# EAGLE board retrostoneH3-18 (EAGLE 7.6.0), part 1 of 4
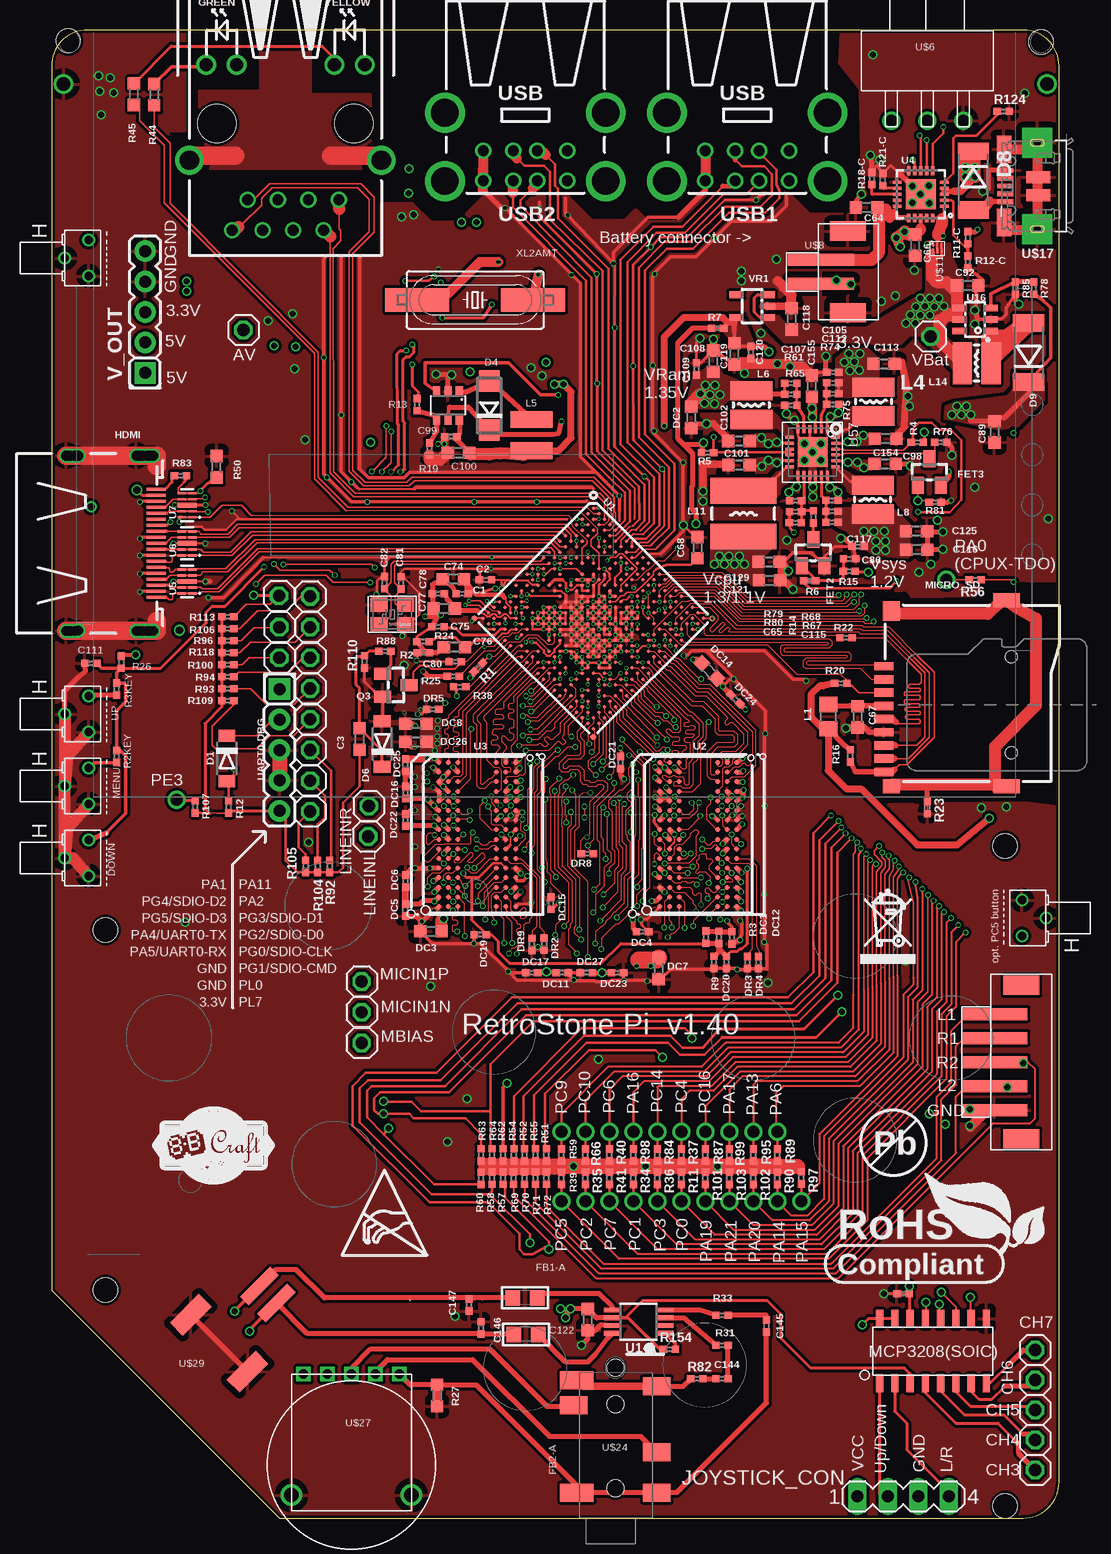
[diagram p6: board, top side]
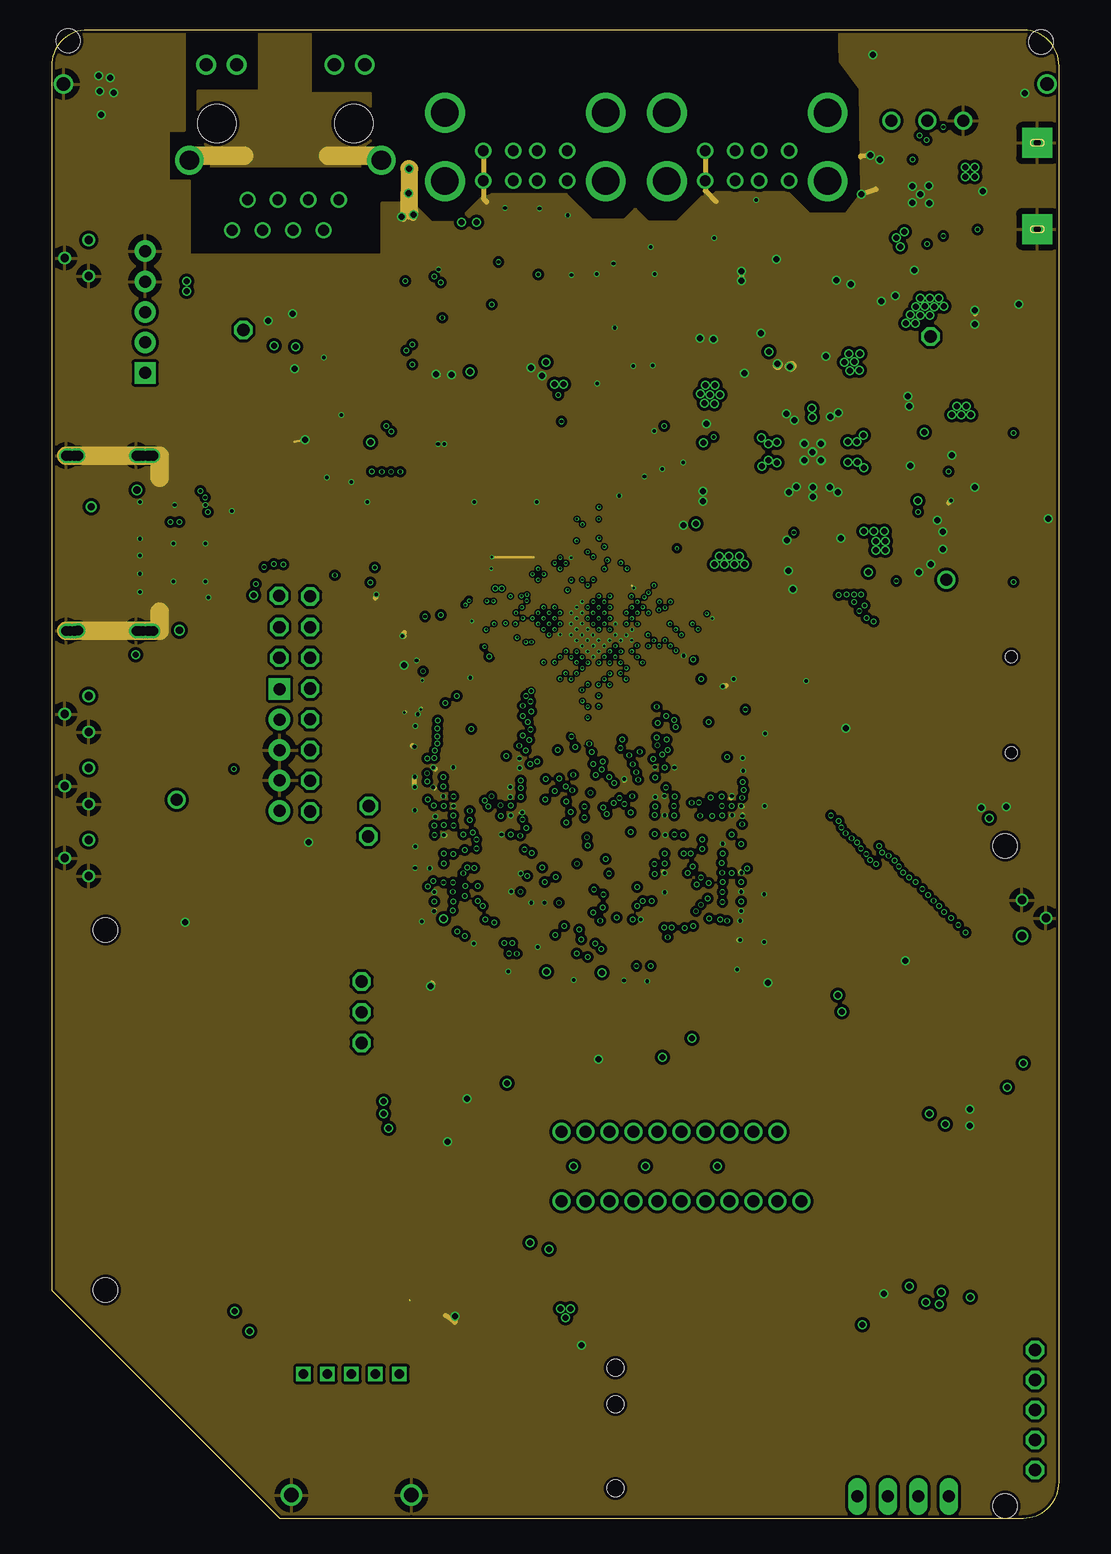
[diagram p7: board, inner layer GND]
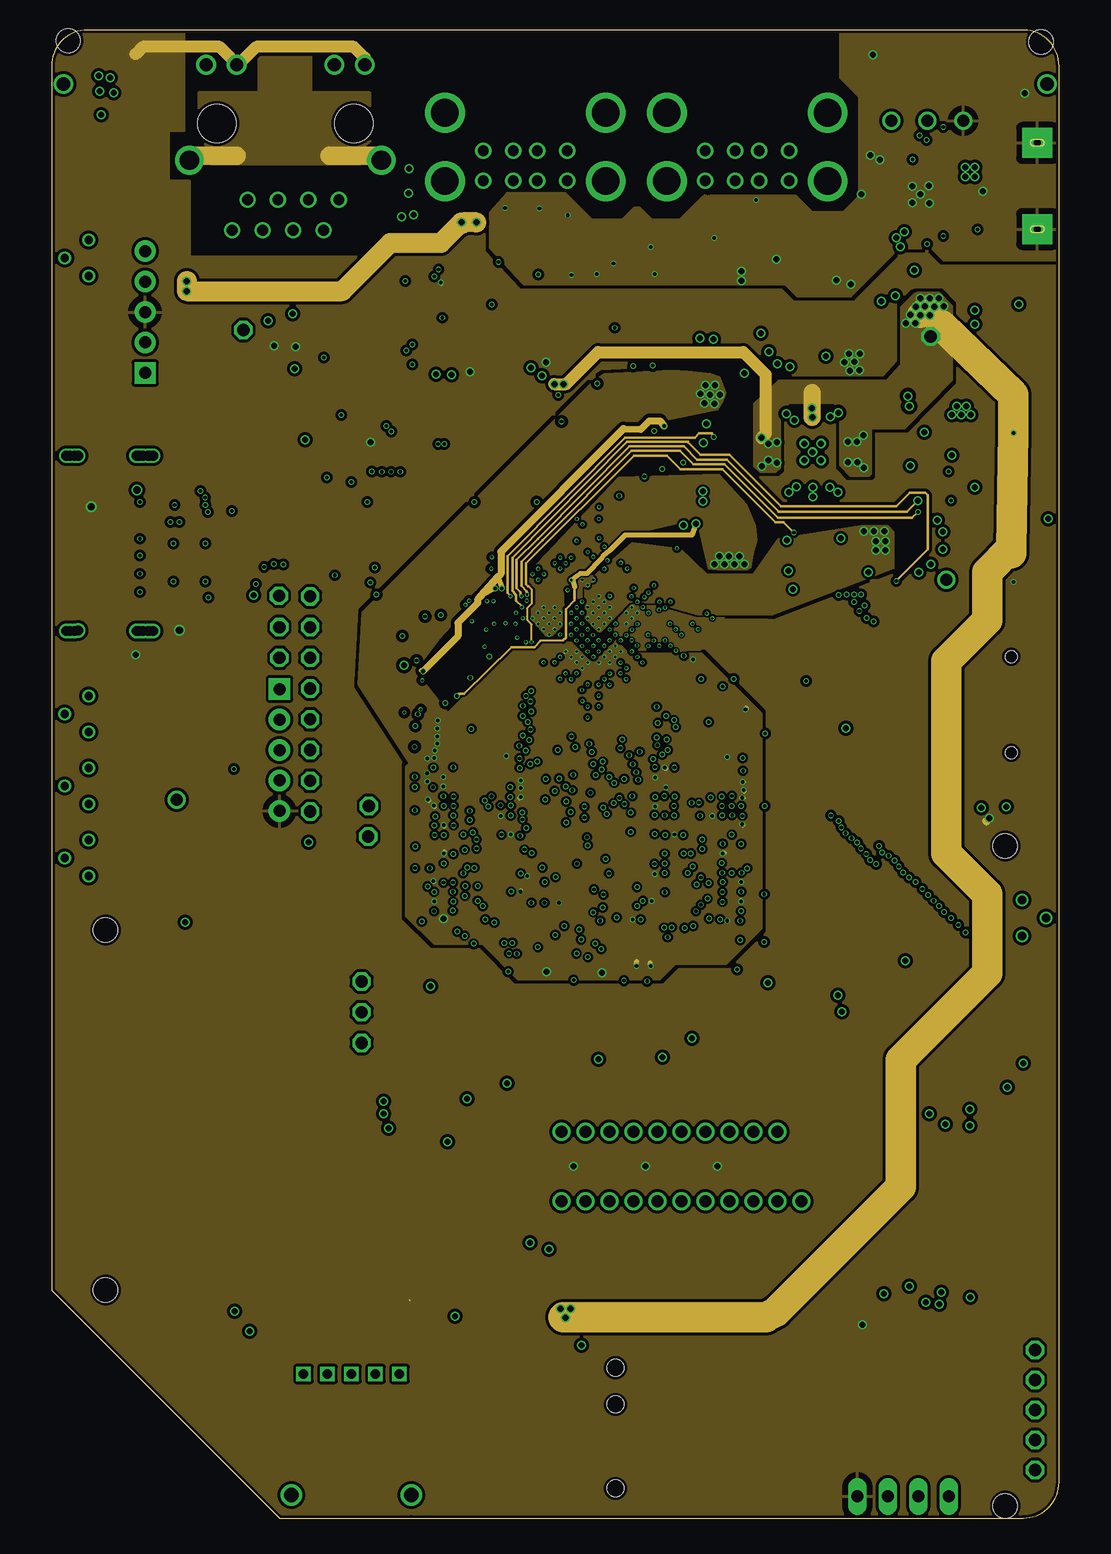
[diagram p8: board, inner layer PWR]
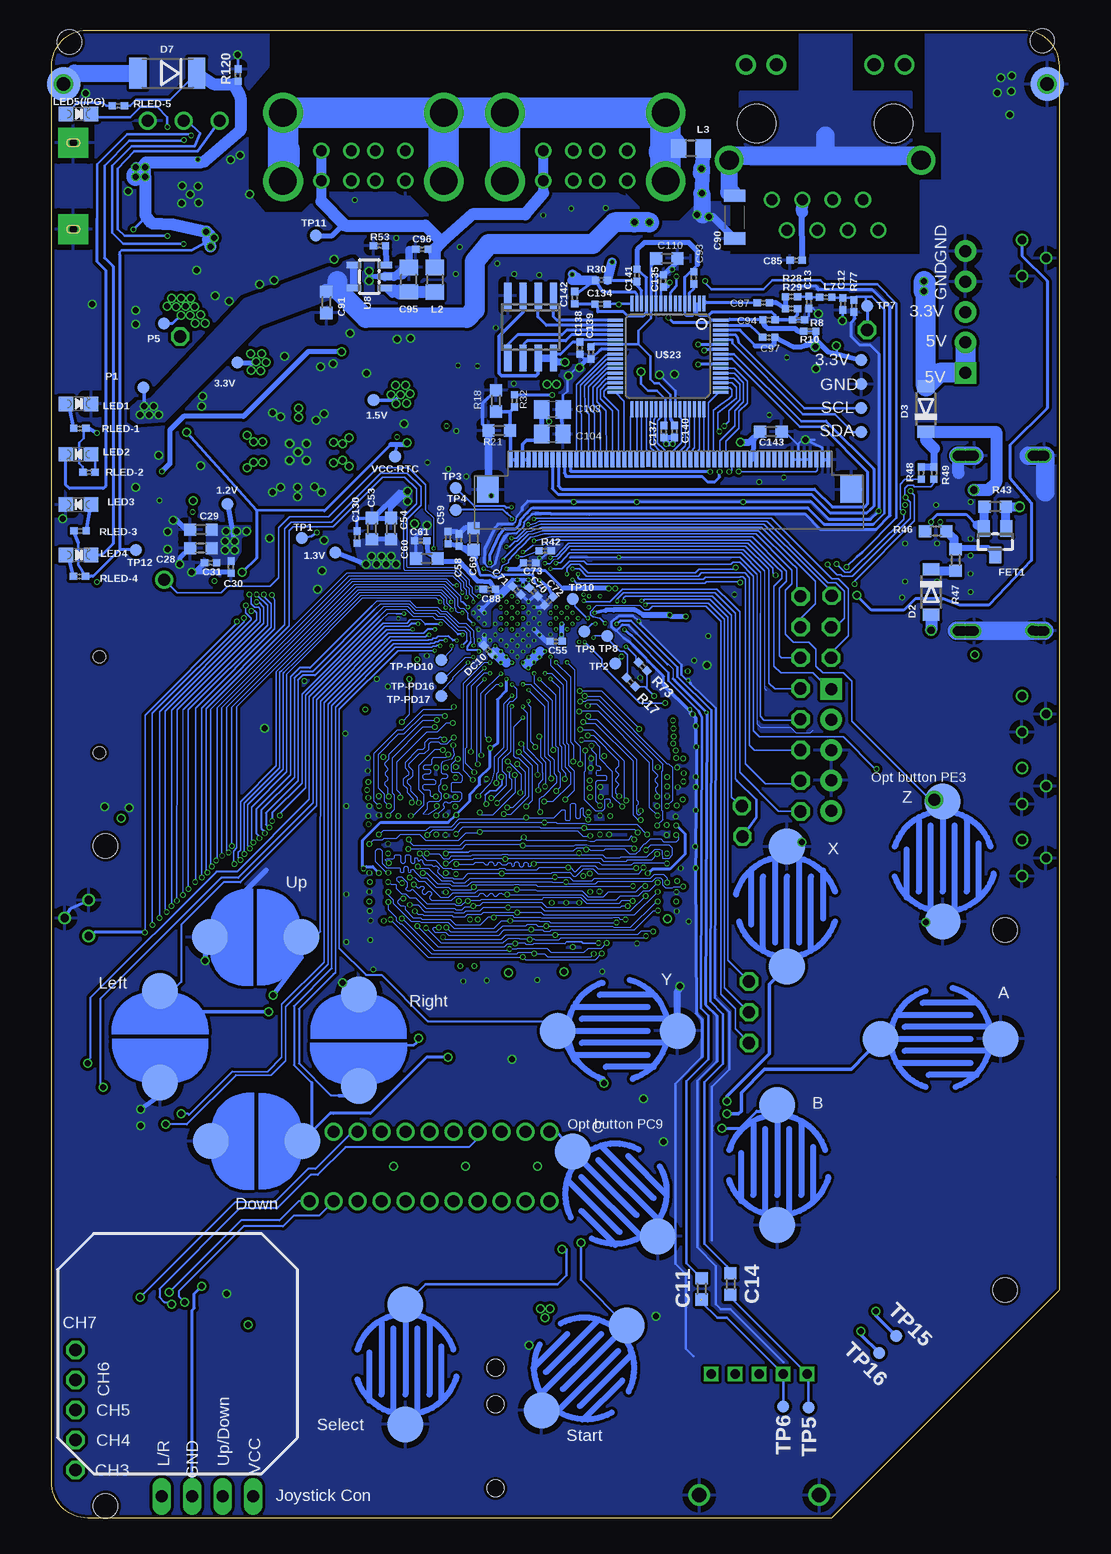
[diagram p9: board, bottom side, seen from below]

Size 84 x 124 mm. Coordinates in mm from the lower left corner, seen from the top.
Outline: 3,124 arc90 0,121 0,28.4 0,19 19,0 30,0 81,0 arc90 84,3 84,121 arc94 80.77,123.99 80.62,123.99 80.37,124 3,124
Copper layers (1*2+15*16): Top 0.035mm / dielectric 5mil / GND 0.035mm / dielectric 0.5mm / PWR 0.035mm / dielectric 5mil / Bottom 0.035mm
Design rules "default *": minimum track width 4mil, minimum drill 0.2mm, track to track 5mil, track to pad 5mil, pad to pad 5mil, via to via 5mil, smd to smd 1mil, copper to edge 10mil, drill to drill 8mil, minimum pad ring 6mil, minimum via ring 2.5mil, stop-mask expansion 4mil, vias tented up to drill 28mil, thermal gap 20mil
Holes 2 mm at 4.5,49 82.5,123 79.5,56 79.5,1 1.4,123.1 4.5,19
Holes 1.4 mm at 47,12.52
tKeepout: area 1,15.5 to 8,22.5; 8 lines
bKeepout: area 2.4,16.9 to 6.6,21.1; 34 lines
tRestrict: area 71,108.8 to 73.9,111.8; 14 lines

## Footprints (pad centres in the part's own frame; a part is rotated, then mirrored left to right if it is on the bottom)
TESTPAD_40-ROUND = smd 1.016 x 1.016: 1 0,0
PADS_DIRECTION = smd 3 x 3: P$1 0,3.81; P$2 0,-3.81
C0402_TI = smd 0.61 x 0.584: 1 -0.508,0; 2 0.508,0
C0603_DWS = smd 1.016 x 1.016: 1 -0.889,0; 2 0.889,0
C1206_5MILS_WS_ISO = smd 1.016 x 1.778: 1 -1.778,0; 2 1.778,0
C0805_5MIL_DWS = smd 1.27 x 1.524: 1 -1.016,0; 2 1.016,0
C0805_5MIL = smd 1.27 x 1.524: 1 -0.889,0; 2 0.889,0
1X01 = drill 1.016 octagon: 1 0,0
RJLBC-060TC1_MILLING = drill 0.9: 1 -4.455,6.35; 2 -3.185,8.89; 3 -1.915,6.35; 4 -0.645,8.89; 5 0.625,6.35; 6 1.895,8.89; 7 3.165,6.35; 8 4.435,8.89 | drill 1.1: AG 4.07,-4.9; AY -6.61,-4.9; KG 6.61,-4.9; KY -4.07,-4.9 | drill 1.6: GND1 -8,3.05; GND2 8,3.05 | hole 3.2: -5.715,0; 5.715,0
SOD-123 = smd 1 x 1.4: A 1.9,0; C -1.9,0
DO214AC = smd 1.8 x 1.7: A 2.05,0; C -2.05,0
MELF-MLL41 = smd 1.45 x 2.6: 1 -2.445,0; 2 2.445,0
R0402_TI = smd 0.61 x 0.584: 1 -0.508,0; 2 0.508,0
CONTACTPIN_ENERGYSQUARE_OD_1MM = drill 1.1: P$1 0,0 | smd 2.8 x 2.8: P$2 0,0
_0805 = smd 1.2 x 1.3: 1 -1.016,0; 2 1.016,0
SOT23 = smd 1.4 x 1: 1 1.1,-0.95; 2 1.1,0.95; 3 -1.1,0
FPC_HAYATO = smd 0.3 x 1.25: 1 1,1.4; 2 1.5,1.4; 3 2,1.4; 4 2.5,1.4; 5 3,1.4; 6 3.5,1.4; 7 4,1.4; 8 4.5,1.4; 9 5,1.4; 10 5.5,1.4; 11 6,1.4; 12 6.5,1.4; 13 7,1.4; 14 7.5,1.4; 15 8,1.4; 16 8.5,1.4; 17 9,1.4; 18 9.5,1.4; 19 10,1.4; 20 10.5,1.4; 21 11,1.4; 22 11.5,1.4; 23 12,1.4; 24 12.5,1.45; 25 13,1.4; 26 13.5,1.4; 27 14,1.4; 28 14.5,1.4; 29 15,1.4; 30 15.5,1.4; 31 16,1.4; 32 16.5,1.4; 33 17,1.4; 34 17.5,1.4; 35 18,1.4; 36 18.5,1.4; 37 19,1.4; 38 19.5,1.4; 39 20,1.4; 40 20.5,1.4; 41 21,1.4; 42 21.5,1.4; 43 22,1.4; 44 22.5,1.4; 45 23,1.4; 46 23.5,1.4; 47 24,1.4; 48 24.5,1.4; 49 25,1.4; 50 25.5,1.4; 51 26,1.4; 52 26.5,1.4; 53 27,1.4; 54 27.5,1.4 | smd 1.8 x 2.2: P$1 -0.9,-1.1; P$56 29.4,-1.1
HDMI-SWM-19 = smd 0.25 x 1.6: 1 -4.5,-5.55; 2 -4,-5.55; 3 -3.5,-5.55; 4 -3,-5.55; 5 -2.5,-5.55; 6 -2,-5.55; 7 -1.5,-5.55; 8 -1,-5.55; 9 -0.5,-5.55; 10 0,-5.55; 11 0.5,-5.55; 12 1,-5.55; 13 1.5,-5.55; 14 2,-5.55; 15 2.5,-5.55; 16 3,-5.55; 17 3.5,-5.55; 18 4,-5.55; 19 4.5,-5.55 | drill 0.8: P$5 -7.3,-4.85; P$7 -7.3,1.25; P$9 7.3,1.25; P$11 7.3,-4.85; P$13 -7.3,-4.45; P$15 -7.3,1.65; P$18 7.3,1.65; P$20 7.3,-4.45; P$21 -7.3,-4.15; P$22 -7.3,-5; P$23 7.3,-5; P$24 7.3,-4.15; P$25 -7.3,-5.3; P$26 7.3,-5.3; P$27 7.3,0.95; P$28 -7.275,0.95; SH1 -7.3,-3.9; SH2 -7.3,1.95; SH3 7.3,1.95; SH4 7.3,-3.9
MA04-1 = drill 1.016 long: 1 -3.81,0; 2 -1.27,0; 3 1.27,0; 4 3.81,0
PAD_BUTTON = smd 3 x 3: P$1 -5,0; P$2 5,0
L0805_5MIL_DWS = smd 1.27 x 1.524: 1 -1.016,0; 2 1.016,0
CD32 = smd 1.6 x 3.5: 1 -1.2,0; 2 1.2,0
CD32_INDUCTOR = smd 3.5 x 1.4: P$1 0,-1.3; P$2 0,1.3
CD52(53) = smd 2.15 x 5.5: 1 -1.9,0; 2 1.9,0
CHIPLED_0805_NOOUTLINE = smd 1.2 x 1.2: A 0,-1.05; C 0,1.05
TFC-WPAPR-08 = smd 1.6 x 0.7: 1 -7.375,2.25; 2 -7.375,1.15; 3 -7.375,0.05; 4 -7.375,-1.05; 5 -7.375,-2.15; 6 -7.375,-3.25; 7 -7.375,-4.35; 8 -7.375,-5.45; 9 -7.375,-6.55 | smd 1.4 x 1.2: 10 -6.75,-7.75 | smd 1.4 x 1.6: 11 -6.75,6.85 | smd 2.2 x 1.2: 12 2.85,-7.75; 13 2.85,7.75 | hole 1: 3.25,-4.95; 3.25,3.05
TSX-3225 = smd 1.4 x 1.15: P$1 -1.1,-0.8; P$2 1.1,-0.8; P$3 1.1,0.8; P$4 -1.1,0.8
R0402_TI_0R = smd 0.61 x 0.584: 1 -0.508,0; 2 0.508,0
R0603_5MIL_DWS = smd 1.016 x 1.016: 1 -0.889,0; 2 0.889,0
0603_0R = smd 1.016 x 1.016: 1 -0.889,0; 2 0.889,0
FBGA-347 = smd 0.3 x 0.3: A1 -6.5,-6.5; A2 -6.5,-5.85; A3 -6.5,-5.2; A4 -6.5,-4.55; A5 -6.5,-3.9; A7 -6.5,-2.6; A8 -6.5,-1.95; A10 -6.5,-0.65; A11 -6.5,0; A13 -6.5,1.3; A14 -6.5,1.95; A16 -6.5,3.25; A17 -6.5,3.9; A19 -6.5,5.2; A20 -6.5,5.85; A21 -6.5,6.5; AA1 6.5,-6.5; AA2 6.5,-5.85; AA3 6.5,-5.2; AA5 6.5,-3.9; AA6 6.5,-3.25; AA8 6.5,-1.95; AA9 6.5,-1.3; AA11 6.5,0; AA12 6.5,0.65; AA14 6.5,1.95; AA15 6.5,2.6; AA17 6.5,3.9; AA18 6.5,4.55; AA19 6.5,5.2; AA20 6.5,5.85; AA21 6.5,6.5; B1 -5.85,-6.5; B2 -5.85,-5.85; B3 -5.85,-5.2; B4 -5.85,-4.55; B5 -5.85,-3.9; B6 -5.85,-3.25; B7 -5.85,-2.6; B8 -5.85,-1.95; B9 -5.85,-1.3; B10 -5.85,-0.65; B11 -5.85,0; B12 -5.85,0.65; B13 -5.85,1.3; B14 -5.85,1.95; B15 -5.85,2.6; B16 -5.85,3.25; B17 -5.85,3.9; B18 -5.85,4.55; B19 -5.85,5.2; B20 -5.85,5.85; B21 -5.85,6.5; C1 -5.2,-6.5; C2 -5.2,-5.85; C3 -5.2,-5.2; C5 -5.2,-3.9; C6 -5.2,-3.25; C7 -5.2,-2.6; C8 -5.2,-1.95; C9 -5.2,-1.3; C10 -5.2,-0.65; C11 -5.2,0; C12 -5.2,0.65; C13 -5.2,1.3; C14 -5.2,1.95; C15 -5.2,2.6; C16 -5.2,3.25; C17 -5.2,3.9; C18 -5.2,4.55; C19 -5.2,5.2; C20 -5.2,5.85; C21 -5.2,6.5; D1 -4.55,-6.5; D2 -4.55,-5.85; D3 -4.55,-5.2; D5 -4.55,-3.9; D6 -4.55,-3.25; D8 -4.55,-1.95; D10 -4.55,-0.65; D11 -4.55,0; D13 -4.55,1.3; D15 -4.55,2.6; D17 -4.55,3.9; D19 -4.55,5.2; D20 -4.55,5.85; E2 -3.9,-5.85; E3 -3.9,-5.2; E8 -3.9,-1.95; E10 -3.9,-0.65; E11 -3.9,0; E13 -3.9,1.3; E14 -3.9,1.95; E15 -3.9,2.6; E16 -3.9,3.25; E18 -3.9,4.55; E19 -3.9,5.2; E20 -3.9,5.85; E21 -3.9,6.5; F1 -3.25,-6.5; F2 -3.25,-5.85; F3 -3.25,-5.2; F5 -3.25,-3.9; F6 -3.25,-3.25; F7 -3.25,-2.6; F8 -3.25,-1.95; F10 -3.25,-0.65; F11 -3.25,0; F13 -3.25,1.3; F14 -3.25,1.95; F16 -3.25,3.25; F17 -3.25,3.9; F18 -3.25,4.55; F19 -3.25,5.2; F20 -3.25,5.85; F21 -3.25,6.5; G1 -2.6,-6.5; G2 -2.6,-5.85; G4 -2.6,-4.55; G5 -2.6,-3.9; G7 -2.6,-2.6; G8 -2.6,-1.95; G9 -2.6,-1.3; G10 -2.6,-0.65; G11 -2.6,0; G12 -2.6,0.65; G13 -2.6,1.3; G14 -2.6,1.95; G15 -2.6,2.6; G18 -2.6,4.55; G20 -2.6,5.85; H2 -1.95,-5.85; H3 -1.95,-5.2; H4 -1.95,-4.55; H6 -1.95,-3.25; H7 -1.95,-2.6; H8 -1.95,-1.95; H10 -1.95,-0.65; H11 -1.95,0; H12 -1.95,0.65; H13 -1.95,1.3; H14 -1.95,1.95; H15 -1.95,2.6; H16 -1.95,3.25; H17 -1.95,3.9; H18 -1.95,4.55; H19 -1.95,5.2; H20 -1.95,5.85; H21 -1.95,6.5; J1 -1.3,-6.5; J2 -1.3,-5.85; J3 -1.3,-5.2; J6 -1.3,-3.25; J7 -1.3,-2.6; J8 -1.3,-1.95; J9 -1.3,-1.3; J10 -1.3,-0.65; J11 -1.3,0; J12 -1.3,0.65; J13 -1.3,1.3; J14 -1.3,1.95; J15 -1.3,2.6; J16 -1.3,3.25; J19 -1.3,5.2; J20 -1.3,5.85; J21 -1.3,6.5; K1 -0.65,-6.5; K2 -0.65,-5.85; K3 -0.65,-5.2; K4 -0.65,-4.55; K6 -0.65,-3.25; K7 -0.65,-2.6; K8 -0.65,-1.95; K9 -0.65,-1.3; K10 -0.65,-0.65; K11 -0.65,0; K12 -0.65,0.65; K13 -0.65,1.3; K14 -0.65,1.95; K15 -0.65,2.6; K16 -0.65,3.25; K17 -0.65,3.9; K18 -0.65,4.55; K20 -0.65,5.85; L2 0,-5.85; L5 0,-3.9; L8 0,-1.95; L9 0,-1.3; L10 0,-0.65; L11 0,0; L12 0,0.65; L13 0,1.3; L14 0,1.95; L15 0,2.6; L16 0,3.25; L17 0,3.9; L18 0,4.55; L19 0,5.2; L20 0,5.85; L21 0,6.5; M1 0.65,-6.5; M2 0.65,-5.85; M3 0.65,-5.2; M4 0.65,-4.55; M5 0.65,-3.9; M6 0.65,-3.25; M7 0.65,-2.6; M8 0.65,-1.95; M9 0.65,-1.3; M10 0.65,-0.65; M11 0.65,0; M12 0.65,0.65; M13 0.65,1.3; M14 0.65,1.95; M15 0.65,2.6; M16 0.65,3.25; M19 0.65,5.2; M20 0.65,5.85; M21 0.65,6.5; N1 1.3,-6.5; N2 1.3,-5.85; N3 1.3,-5.2; N7 1.3,-2.6; N8 1.3,-1.95; N9 1.3,-1.3; N10 1.3,-0.65; N11 1.3,0; N12 1.3,0.65; N13 1.3,1.3; N14 1.3,1.95; N15 1.3,2.6; N16 1.3,3.25; N17 1.3,3.9; N19 1.3,5.2; N20 1.3,5.85; P2 1.95,-5.85; P3 1.95,-5.2; P6 1.95,-3.25; P7 1.95,-2.6; P8 1.95,-1.95; P9 1.95,-1.3; P10 1.95,-0.65; P11 1.95,0; P12 1.95,0.65; P13 1.95,1.3; P14 1.95,1.95; P15 1.95,2.6; P16 1.95,3.25; P17 1.95,3.9; P19 1.95,5.2; P20 1.95,5.85; P21 1.95,6.5; R1 2.6,-6.5; R2 2.6,-5.85; R6 2.6,-3.25; R7 2.6,-2.6; R8 2.6,-1.95; R9 2.6,-1.3; R10 2.6,-0.65; R11 2.6,0; R12 2.6,0.65; R13 2.6,1.3; R14 2.6,1.95; R16 2.6,3.25; R17 2.6,3.9; R18 2.6,4.55; R19 2.6,5.2; R20 2.6,5.85; R21 2.6,6.5; T2 3.25,-5.85; T3 3.25,-5.2; T4 3.25,-4.55; T5 3.25,-3.9; T6 3.25,-3.25; T7 3.25,-2.6; T8 3.25,-1.95; T9 3.25,-1.3; T10 3.25,-0.65; T11 3.25,0; T12 3.25,0.65; T13 3.25,1.3; T14 3.25,1.95; T15 3.25,2.6; T16 3.25,3.25; T17 3.25,3.9; T18 3.25,4.55; T20 3.25,5.85; U2 3.9,-5.85; U3 3.9,-5.2; U4 3.9,-4.55; U6 3.9,-3.25; U9 3.9,-1.3; U11 3.9,0; U15 3.9,2.6; U16 3.9,3.25; U18 3.9,4.55; U19 3.9,5.2; U20 3.9,5.85; U21 3.9,6.5; V1 4.55,-6.5; V2 4.55,-5.85; V3 4.55,-5.2; V4 4.55,-4.55; V5 4.55,-3.9; V6 4.55,-3.25; V10 4.55,-0.65; V11 4.55,0; V12 4.55,0.65; V13 4.55,1.3; V15 4.55,2.6; V17 4.55,3.9; V19 4.55,5.2; V20 4.55,5.85; V21 4.55,6.5; W1 5.2,-6.5; W2 5.2,-5.85; W3 5.2,-5.2; W5 5.2,-3.9; W6 5.2,-3.25; W9 5.2,-1.3; W11 5.2,0; W12 5.2,0.65; W13 5.2,1.3; W15 5.2,2.6; W17 5.2,3.9; W18 5.2,4.55; W20 5.2,5.85; W21 5.2,6.5; Y1 5.85,-6.5; Y2 5.85,-5.85; Y3 5.85,-5.2; Y4 5.85,-4.55; Y7 5.85,-2.6; Y8 5.85,-1.95; Y9 5.85,-1.3; Y10 5.85,-0.65; Y11 5.85,0; Y12 5.85,0.65; Y13 5.85,1.3; Y14 5.85,1.95; Y15 5.85,2.6; Y16 5.85,3.25; Y17 5.85,3.9; Y18 5.85,4.55; Y19 5.85,5.2; Y20 5.85,5.85; Y21 5.85,6.5 | smd 0.5 x 0.5: FID1 -7,7; FID2 7,7; FID3 7,-7
MSOP8_0.65MM = smd 0.4 x 1.4: 1 -0.975,-2.2; 2 -0.325,-2.2; 3 0.325,-2.2; 4 0.975,-2.2; 5 0.975,2.2; 6 0.325,2.2; 7 -0.325,2.2; 8 -0.975,2.2
FBGA96(HYNIX_SAMSUNG_512MX16_DDR3) = smd 0.4 x 0.4: A1 -6,-3.2; A2 -6,-2.4; A3 -6,-1.6; A7 -6,1.6; A8 -6,2.4; A9 -6,3.2; B1 -5.2,-3.2; B2 -5.2,-2.4; B3 -5.2,-1.6; B7 -5.2,1.6; B8 -5.2,2.4; B9 -5.2,3.2; C1 -4.4,-3.2; C2 -4.4,-2.4; C3 -4.4,-1.6; C7 -4.4,1.6; C8 -4.4,2.4; C9 -4.4,3.2; D1 -3.6,-3.2; D2 -3.6,-2.4; D3 -3.6,-1.6; D7 -3.6,1.6; D8 -3.6,2.4; D9 -3.6,3.2; E1 -2.8,-3.2; E2 -2.8,-2.4; E3 -2.8,-1.6; E7 -2.8,1.6; E8 -2.8,2.4; E9 -2.8,3.2; F1 -2,-3.2; F2 -2,-2.4; F3 -2,-1.6; F7 -2,1.6; F8 -2,2.4; F9 -2,3.2; G1 -1.2,-3.2; G2 -1.2,-2.4; G3 -1.2,-1.6; G7 -1.2,1.6; G8 -1.2,2.4; G9 -1.2,3.2; H1 -0.4,-3.2; H2 -0.4,-2.4; H3 -0.4,-1.6; H7 -0.4,1.6; H8 -0.4,2.4; H9 -0.4,3.2; J1 0.4,-3.2; J2 0.4,-2.4; J3 0.4,-1.6; J7 0.4,1.6; J8 0.4,2.4; J9 0.4,3.2; K1 1.2,-3.2; K2 1.2,-2.4; K3 1.2,-1.6; K7 1.2,1.6; K8 1.2,2.4; K9 1.2,3.2; L1 2,-3.2; L2 2,-2.4; L3 2,-1.6; L7 2,1.6; L8 2,2.4; L9 2,3.2; M1 2.8,-3.2; M2 2.8,-2.4; M3 2.8,-1.6; M7 2.8,1.6; M8 2.8,2.4; M9 2.8,3.2; N1 3.6,-3.2; N2 3.6,-2.4; N3 3.6,-1.6; N7 3.6,1.6; N8 3.6,2.4; N9 3.6,3.2; P1 4.4,-3.2; P2 4.4,-2.4; P3 4.4,-1.6; P7 4.4,1.6; P8 4.4,2.4; P9 4.4,3.2; R1 5.2,-3.2; R2 5.2,-2.4; R3 5.2,-1.6; R7 5.2,1.6; R8 5.2,2.4; R9 5.2,3.2; T1 6,-3.2; T2 6,-2.4; T3 6,-1.6; T7 6,1.6; T8 6,2.4; T9 6,3.2
QFN20_4MM = smd 0.73 x 0.28: P$1 -1.965,1; P$2 -1.965,0.5; P$3 -1.965,0; P$4 -1.965,-0.5; P$5 -1.965,-1; P$11 1.965,-1; P$12 1.965,-0.5; P$13 1.965,0; P$14 1.965,0.5; P$15 1.965,1 | smd 0.28 x 0.73: P$6 -1,-1.965; P$7 -0.5,-1.965; P$8 0,-1.965; P$9 0.5,-1.965; P$10 1,-1.965; P$16 1,1.965; P$17 0.5,1.965; P$18 0,1.965; P$19 -0.5,1.965; P$20 -1,1.965 | smd 2.5 x 2.5: P$21 0,0
SLP2510P8 = smd 0.2 x 0.675: 1 -1,-0.438; 2 -0.5,-0.438; 4 0.5,-0.438; 5 1,-0.438; 6 1,0.438; 7 0.5,0.438; 9 -0.5,0.438; 10 -1,0.438 | smd 0.4 x 0.775: 3 0,-0.388; 8 0,0.388
SOT23-5 = smd 1.2 x 0.55: 1 1.3,-0.95; 2 1.3,0; 3 1.3,0.95; 4 -1.3,0.95; 5 -1.3,-0.95
SOT23-6 = smd 1.2 x 0.55: 1 1.3,-0.95; 2 1.3,0; 3 1.3,0.95; 4 -1.3,0.95; 5 -1.3,0; 6 -1.3,-0.95
QFN4X4 = smd 0.7 x 0.25: 1 -1.9,1.225; 2 -1.9,0.725; 3 -1.9,0.225; 4 -1.9,-0.225; 5 -1.9,-0.725; 6 -1.9,-1.225; 13 1.9,-1.225; 14 1.9,-0.725; 15 1.9,-0.225; 16 1.9,0.225; 17 1.9,0.725; 18 1.9,1.225 | smd 0.25 x 0.7: 7 -1.225,-1.9; 8 -0.725,-1.9; 9 -0.225,-1.9; 10 0.225,-1.9; 11 0.725,-1.9; 12 1.225,-1.9; 19 1.225,1.9; 20 0.725,1.9; 21 0.225,1.9; 22 -0.225,1.9; 23 -0.725,1.9; 24 -1.225,1.9 | smd 2.45 x 2.45: 25 0,0 | drill 0.5: P$1 -0.7,0.7; P$2 0.7,0.7; P$3 0.7,-0.7; P$4 -0.7,-0.7; P$5 0,0
JST_PH_VERT_5P = smd 1 x 5.5: 3 -4,-2; 4 -2,-2; 5 0,-2; 6 2,-2; 7 4,-2 | smd 1.6 x 3: GND1 -6.4,0.25; GND2 6.4,0.25
SS-12F21(1P2T) = drill 1: IN 0,0; OUT1 -3,0; OUT2 3,0
JST_PH_VERT_2P = smd 1.6 x 3: GND1 -3.4,0.25; GND2 3.4,0.25 | smd 1 x 5.5: P$1 -1,-2; P$2 1,-2
CSD22205L = smd 0.15 x 0.4: D1 -0.35,-0.225 | smd 0.15 x 0.85: D2 0.35,0; S 0,0 | smd 0.15 x 0.25: G -0.35,0.3
SOT23-6' = smd 0.6 x 0.9: 1 -0.95,-1.15; 2 0,-1.15; 3 0.95,-1.15; 4 0.95,1.15; 5 0,1.15; 6 -0.95,1.15
TACT_SWITCH_HORIZONTAL = drill 0.7: GND 0,1; P$2 1.5,-1; P$3 -1.5,-1
MICROUSB_HAYATO = smd 1 x 2: BASE@1 0.75,2.88; BASE@2 -0.75,2.88 | smd 0.4 x 1.35: D+ 0,0.105; D- 0.65,0.105; GND -1.3,0.105; ID -0.65,0.105; VBUS 1.3,0.105 | smd 2.3 x 1.2: P$1 -3.05,0; P$2 3.05,0 | drill 0.6 pad 2.5 square: SPRT@3 3.6,2.78; SPRT@4 -3.6,2.78
SOIC8 = smd 0.6 x 2.2: 1 -1.905,-2.6; 2 -0.635,-2.6; 3 0.635,-2.6; 4 1.905,-2.6; 5 1.905,2.6; 6 0.635,2.6; 7 -0.635,2.6; 8 -1.905,2.6
LQFP-ST-64-2 = smd 1.3 x 0.25: 1 -4.4,3; 2 -4.4,2.6; 3 -4.4,2.2; 4 -4.4,1.8; 5 -4.4,1.4; 6 -4.4,1; 7 -4.4,0.6; 8 -4.4,0.2; 9 -4.4,-0.2; 10 -4.4,-0.6; 11 -4.4,-1; 12 -4.4,-1.4; 13 -4.4,-1.8; 14 -4.4,-2.2; 15 -4.4,-2.6; 16 -4.4,-3; 33 4.4,-3; 34 4.4,-2.6; 35 4.4,-2.2; 36 4.4,-1.8; 37 4.4,-1.4; 38 4.4,-1; 39 4.4,-0.6; 40 4.4,-0.2; 41 4.4,0.2; 42 4.4,0.6; 43 4.4,1; 44 4.4,1.4; 45 4.4,1.8; 46 4.4,2.2; 47 4.4,2.6; 48 4.4,3 | smd 0.25 x 1.3: 17 -3,-4.4; 18 -2.6,-4.4; 19 -2.2,-4.4; 20 -1.8,-4.4; 21 -1.4,-4.4; 22 -1,-4.4; 23 -0.6,-4.4; 24 -0.2,-4.4; 25 0.2,-4.4; 26 0.6,-4.4; 27 1,-4.4; 28 1.4,-4.4; 29 1.8,-4.4; 30 2.2,-4.4; 31 2.6,-4.4; 32 3,-4.4; 49 3,4.4; 50 2.6,4.4; 51 2.2,4.4; 52 1.8,4.4; 53 1.4,4.4; 54 1,4.4; 55 0.6,4.4; 56 0.2,4.4; 57 -0.2,4.4; 58 -0.6,4.4; 59 -1,4.4; 60 -1.4,4.4; 61 -1.8,4.4; 62 -2.2,4.4; 64 -3,4.4 | smd 0.24 x 1.3: 63 -2.6,4.4
PJ342_6P = smd 1.5 x 2.3: 1 2.15,-3.45; 3 5.5,-3.45; 4 9.45,3.45; 5 11,-3.45 | smd 1.5 x 2.8: 2 2.15,3.2; 6 11.5,3.2 | hole 1.4: 9.5,0; 2.5,0
WHEEL_POT = drill 0.8 square: 2A -2,0; 2B 0,0; 3A 4,0; 3B 2,0; GND -4,0 | drill 1.2: GND1 -5,10.1; GND2 5,10.1
JST2_HAYATO = smd 1 x 3.5: GND 1.6,-4.05; VCC 3.6,-4.05 | smd 1.5 x 3.4: GND2 -0.75,1.7; GND3 5.95,1.7
MCP3208 = smd 0.6 x 1.5: P$1 -4.445,-2.7; P$2 -3.175,-2.7; P$3 -1.905,-2.7; P$4 -0.635,-2.7; P$5 0.635,-2.7; P$6 1.905,-2.7; P$7 3.175,-2.7; P$8 4.445,-2.7; P$9 4.445,2.7; P$10 3.175,2.7; P$11 1.905,2.7; P$12 0.635,2.7; P$13 -0.635,2.7; P$14 -1.905,2.7; P$15 -3.175,2.7; P$16 -4.45,2.7
HN1X5 = drill 1 pad 1.778 square: 1 -5.08,0 | drill 1 pad 1.778: 2 -2.54,0; 3 0,0; 4 2.54,0; 5 5.08,0
USB_TWO_LEVEL_ALINKTEK = drill 0.9: 1.1 -3.5,2.97; 1.2 -1,2.97; 1.3 1,2.97; 1.4 3.5,2.97; 2.1 -3.5,0.47; 2.2 -1,0.47; 2.3 1,0.47; 2.4 3.5,0.47 | drill 2.3: GND1 -6.7,-2.7; GND2 6.7,-2.7; GND3 6.7,3; GND4 -6.7,3
SOT-23-5 = smd 1.2 x 0.55: 1 1.3,-0.95; 2 1.3,0; 3 1.3,0.95; 4 -1.3,0.95; 5 -1.3,-0.95
HC49UP = smd 5.334 x 1.93: 1 -4.826,0; 2 4.826,0

## Placement (x,y rotation side)
1.2V  TESTPADTESTPAD_40-ROUND  [TESTPAD_40-ROUND]  69.32,84.5 0 bottom
1.3V  TESTPADTESTPAD_40-ROUND  [TESTPAD_40-ROUND]  60.33,80.47 270 bottom
1.5V  TESTPADTESTPAD_40-ROUND  [TESTPAD_40-ROUND]  57.15,93.16 180 bottom
3.3V  TESTPADTESTPAD_40-ROUND  [TESTPAD_40-ROUND]  68.5,96.29 90 bottom
AD  PAD_DIRECTION  [PADS_DIRECTION]  66.9,31.4 270 bottom
AL  PAD_DIRECTION  [PADS_DIRECTION]  74.96,40.11 0 bottom
AR  PAD_DIRECTION  [PADS_DIRECTION]  58.4,39.8 180 bottom
AU  PAD_DIRECTION  [PADS_DIRECTION]  67,48.4 270 bottom
C1  100nF/6.3V  [C0402_TI]  34.22,77.02 180 top
C2  100nF/6.3V  [C0402_TI]  36.18,78.17 0 top
C3  10uF/6.3V  [C0603_DWS]  25.68,64.92 90 top
C11  4.7uF/6.3V  [C0603_DWS]  29.8,19.1 90 bottom
C12  150pF  [C0402_TI]  18.02,101.17 90 bottom
C13  150pF  [C0402_TI]  20.87,101.31 90 bottom
C14  4.7uF/6.3V  [C0603_DWS]  27.4,19.5 90 bottom
C28  10uF/6.3V  [C0603_DWS]  71.55,80.82 180 bottom
C29  4.7uF/6.3V  [C0603_DWS]  71.55,82.36 0 bottom
C30  1uF/6.3V  [C0402_TI]  69.04,79.24 90 bottom
C31  100nF/6.3V  [C0402_TI]  70.74,79.6 0 bottom
C53  10uF/6.3V  [C0603_DWS]  57.29,82.44 90 bottom
C54  4.7uF/6.3V  [C0603_DWS]  55.71,82.44 90 bottom
C55  100nF/6.3V  [C0402_TI]  41.94,73.04 0 bottom
C58  1uF/6.3V  [C0402_TI]  50.03,81.5 90 bottom
C59  100nF/6.3V  [C0402_TI]  50.94,81.69 270 bottom
C60  10uF/6.3V  [C0603_DWS]  52.71,79.96 180 bottom
C61  100nF/6.3V  [C0402_TI]  53.23,81.43 0 bottom
C64  10uF/6.3V  [C0603_DWS]  67.95,109.21 0 top
C65  220pF/6.3V  [C0402_TI]  62.01,82.95 0 top
C66  10uF/6.3V  [C0603_DWS]  71.99,106.07 90 top
C67  22uF/6.3V  [C0603_DWS]  67.21,66.76 90 top
C68  10uF/6.3V  [C0603_DWS]  53.86,80.86 90 top
C69  10uF/6.3V  [C0603_DWS]  48.81,81.58 90 bottom
C70  100nF/6.3V  [C0402_TI]  43.82,77.17 135 bottom
C71  100nF/6.3V  [C0402_TI]  45.22,77.3 135 bottom
C72  100nF/6.3V  [C0402_TI]  42.55,76.41 45 bottom
C73  100nF/6.3V  [C0402_TI]  44.14,79.59 180 bottom
C74  10uF/6.3V  [C0603_DWS]  33.51,78.23 0 top
C75  1uF/6.3V  [C0402_TI]  32.21,74.28 0 top
C76  10uF/6.3V  [C0603_DWS]  33.59,72.58 0 top
C77  10uF/6.3V  [C0603_DWS]  32.73,75.79 0 top
C78  100nF/6.3V  [C0402_TI]  32.24,77.02 0 top
C80  100nF/6.3V  [C0402_TI]  33.65,71.36 0 top
C81  18pF  [C0402_TI]  29.14,77.92 270 top
C82  18pF  [C0402_TI]  27.75,77.95 270 top
C85  100nF/6.3V  [C0402_TI]  21.92,104.83 0 bottom
C86  NC  [C0402_TI]  66.53,79.92 0 top
C87  22nF  [C0402_TI]  24.66,101.28 180 bottom
C88  100nF/6.3V  [C0402_TI]  47.49,77.39 0 bottom
C89  22uF/6.3V  [C0603_DWS]  78.61,90.52 270 top
C90  1nF/2kV/X7R/1206  [C1206_5MILS_WS_ISO]  27.04,108.4 90 bottom
C91  22uF/6.3V  [C0603_DWS]  61.09,101.31 270 bottom
C92  22uF/6.3V  [C0603_DWS]  76.38,102.71 180 top
C93  22nF  [C0402_TI]  30.46,103.34 270 bottom
C94  22nF  [C0402_TI]  24.19,99.86 180 bottom
C95  47uF/6.3V  [C0805_5MIL_DWS]  54.21,103.2 90 bottom
C96  100nF/6.3V  [C0402_TI]  53.12,105.73 180 bottom
C97  1uF/6.3V  [C0402_TI]  24.2,98.38 0 bottom
C98  10uF/6.3V  [C0603_DWS]  69.5,87.85 180 top
C99  100nF/6.3V  [C0402_TI]  33.28,90.12 0 top
C100  10uF/6.3V  [C0603_DWS]  33.93,88.77 0 top
C101  10uF/6.3V  [C0603_DWS]  57.32,87.74 0 top
C102  10uF/6.3V  [C0603_DWS]  57.3,89.75 0 top
C103  100nF/25V  [C0805_5MIL]  42.23,92.37 180 bottom
C104  10uF/25V  [C0805_5MIL]  42.24,90.32 180 bottom
C105  100nF/6.3V  [C0402_TI]  65.12,95.49 180 top
C107  22pF  [C0402_TI]  61.64,94.56 0 top
C108  22uF/6.3V  [C0603_DWS]  55.16,96.41 90 top
C109  100nF/6.3V  [C0402_TI]  53.78,95.77 90 top
C110  4.7uF/6.3V  [C0603_DWS]  32.7,104.96 180 bottom
C111  100nF/6.3V  [C0402_TI]  3.27,71.23 0 top
C112  22pF  [C0402_TI]  65.12,94.59 180 top
C113  22uF/6.3V  [C0603_DWS]  69.4,96.18 0 top
C115  33pF  [C0402_TI]  65.07,82.98 180 top
C116  22uF/6.3V  [C0603_DWS]  72.13,80.7 0 top
C117  100nF/6.3V  [C0402_TI]  67.26,80.96 180 top
C118  4.7uF/6.3V  [C0603_DWS]  61.7,99.93 90 top
C119  4.7uF/6.3V  [C0603_DWS]  56.93,97.02 270 top
C120  100nF/6.3V  [C0402_TI]  58.3,97.12 270 top
C121  10uF/6.3V  [C0603_DWS]  59.85,78.14 180 top
C122  10uF/6.3V  [C0603_DWS]  44.69,16.53 90 top
C125  10uF/6.3V  [C0603_DWS]  72.1,82.24 180 top
C129  22uF/6.3V  [C0603_DWS]  59.81,79.69 0 top
C130  100nF/6.3V  [C0402_TI]  58.52,81.73 90 bottom
C134  100nF/6.3V  [C0402_TI]  38.18,101.16 0 bottom
C135  100nF/6.3V  [C0402_TI]  33,103.09 270 bottom
C137  100nF/6.3V  [C0402_TI]  32.96,90.54 90 bottom
C138  100nF/6.3V  [C0402_TI]  39.96,97.48 90 bottom
C139  100nF/6.3V  [C0402_TI]  39.02,97.1 90 bottom
C140  100nF/6.3V  [C0402_TI]  32.06,90.54 90 bottom
C141  20pF  [C0402_TI]  35.18,103.55 270 bottom
C142  20pF  [C0402_TI]  40.38,101.7 90 bottom
C143  4.7uF/6.3V  [C0603_DWS]  24.03,90.53 180 bottom
C144  1uF/6.3V  [C0402_TI]  55.9,11.6 0 top
C145  1uF/6.3V  [C0402_TI]  59.6,16 90 top
C146  220pF/6.3V  [C0402_TI]  35.8,15.85 270 top
C147  220pF/6.3V  [C0402_TI]  34.8,17.75 90 top
C154  10uF/6.3V  [C0603_DWS]  69.53,89.94 180 top
C155  10uF/6.3V  [C0603_DWS]  63.39,94.32 270 top
CH3  [1X01]  82,4 0 top
CH4  [1X01]  82,6.5 0 top
CH5  [1X01]  82,9 0 top
CH6  [1X01]  82,11.5 0 top
CH7  [1X01]  82,14 0 top
CON1  RJLBC-060TC1_GND_MILLING  [RJLBC-060TC1_MILLING]  19.5,116.2 180 top
D1  1N5819(S4SOD-123)  [SOD-123]  14.61,63.29 270 top
D2  1N5819(S4SOD-123)  [SOD-123]  10.67,77.16 270 bottom
D3  1N5819(S4SOD-123)  [SOD-123]  11.11,92.41 90 bottom
D4  SS14  [DO214AC]  36.5,92.71 90 top
D6  1N5819(S4SOD-123)  [SOD-123]  27.56,64.5 90 top
D7  1N5822/SS34/SMA  [MELF-MLL41]  74.35,120.4 180 bottom
D8  1N5822/SS34/SMA  [MELF-MLL41]  76.85,111.45 270 top
D9  1N5822/SS34/SMA  [MELF-MLL41]  81.45,97.13 90 top
DC1  100nF/6.3V  [C0402_TI]  55.63,48.39 270 top
DC2  10uF/6.3V  [C0603_DWS]  53.33,91.7 270 top
DC3  4.7uF/6.3V  [C0603_DWS]  31.63,48.89 180 top
DC4  1uF/6.3V  [C0402_TI]  49.26,48.85 180 top
DC5  1uF/6.3V  [C0402_TI]  29.5,50.67 90 top
DC6  100nF/6.3V  [C0402_TI]  29.51,53.08 270 top
DC7  4.7uF/6.3V  [C0603_DWS]  50.63,45.77 270 top
DC8  10uF/6.3V  [C0603_DWS]  30.39,66.2 180 top
DC10  1uF/6.3V  [C0402_TI]  47.59,72.33 315 bottom
DC11  100nF/6.3V  [C0402_TI]  42.57,45.45 180 top
DC12  1uF/6.3V  [C0402_TI]  56.72,48.35 90 top
DC14  10uF/6.3V  [C0603_DWS]  54.85,70.59 315 top
DC15  1uF/6.3V  [C0402_TI]  41.65,51.23 270 top
DC16  1uF/6.3V  [C0402_TI]  29.5,60.46 270 top
DC17  100nF/6.3V  [C0402_TI]  40.03,45.44 0 top
DC19  100nF/6.3V  [C0402_TI]  35.74,48.62 0 top
DC20  100nF/6.3V  [C0402_TI]  56.26,46.3 90 top
DC21  100nF/6.3V  [C0402_TI]  47.44,62.94 90 top
DC22  100nF/6.3V  [C0402_TI]  29.5,58.16 270 top
DC23  100nF/6.3V  [C0402_TI]  47.19,45.43 180 top
DC24  100nF/6.3V  [C0402_TI]  57.01,68.23 315 top
DC25  1uF/6.3V  [C0402_TI]  29.49,62.74 90 top
DC26  10uF/6.3V  [C0603_DWS]  30.39,64.68 180 top
DC27  1uF/6.3V  [C0402_TI]  44.59,45.45 0 top
DR2  240R/1%  [R0402_TI]  41.07,47.83 90 top
DR3  240R/1%  [R0402_TI]  58.01,46.29 90 top
DR4  240R/1%  [R0402_TI]  58.92,46.29 90 top
DR5  240R/1%  [R0402_TI]  31.78,67.4 0 top
DR8  100R/1%  [R0402_TI]  44.66,55.36 180 top
DR9  240R/1%  [R0402_TI]  40.04,47.8 90 top
ENERGYSQUARE_GND  CONTACTPIN_ENERGYSQUARE1MM  [CONTACTPIN_ENERGYSQUARE_OD_1MM]  1,119.5 0 bottom
ENERGYSQUARE_VBUS  CONTACTPIN_ENERGYSQUARE1MM  [CONTACTPIN_ENERGYSQUARE_OD_1MM]  83,119.5 0 bottom
FB1-A  BLM21PG220SH1D (Ferrite)  [_0805]  39.47,18.35 180 top
FB2-A  BLM21PG220SH1D (Ferrite)  [_0805]  39.55,15.3 180 top
FET1  BSN20(SOT23-3)  [SOT23]  5.33,81.35 90 bottom
FET2  BSN20(SOT23-3)  [SOT23]  63.5,80.45 270 top
FET3  AO3423-PMOS  [SOT23]  73.18,87.17 270 top
FPC54P  FPC_HAYATO  [FPC_HAYATO]  46.74,86.8 0 bottom
HDMI  HDMI-SWM-19  [HDMI-SWM-19]  3.17,81.22 90 top
JOYSTICK_CON  [MA04-1]  71,1.8 0 top
JP1  [1X01]  16,99 0 top
JP2  [1X01]  73.28,98.46 0 top
JP3  [1X01]  26.45,59.33 0 top
JP4  [1X01]  26.4,56.79 0 top
JP5  [1X01]  25.85,39.59 0 top
JP6  [1X01]  25.85,44.71 0 top
JP7  [1X01]  25.85,42.15 0 top
JP8  [1X01]  21.56,66.56 0 top
JP9  [1X01]  21.56,64 0 top
JP10  [1X01]  21.56,69.12 0 top
JP11  [1X01]  21.56,71.68 0 top
JP12  [1X01]  19,74.24 0 top
JP13  [1X01]  19,71.68 0 top
JP14  [1X01]  21.56,61.44 0 top
JP15  [1X01]  21.56,58.88 0 top
JP16  [1X01]  21.56,76.8 0 top
JP17  [1X01]  21.56,74.24 0 top
JP18  [1X01]  18.96,76.85 0 top
K1  PAD_BUTTON  [PAD_BUTTON]  22.69,50.95 90 bottom
K2  PAD_BUTTON  [PAD_BUTTON]  9.88,39.93 0 bottom
K3  PAD_BUTTON  [PAD_BUTTON]  36.8,40.6 0 bottom
K4  PAD_BUTTON  [PAD_BUTTON]  23.5,29.4 270 bottom
L1  FB0805/600R/2A  [L0805_5MIL_DWS]  64.76,66.78 90 top
L2  FB0805/600R/2A  [L0805_5MIL_DWS]  52.04,103.18 270 bottom
L3  FB0805/600R/2A  [L0805_5MIL_DWS]  30.7,114.12 180 bottom
L4  2.2uH/2.0A/DCR<0.1R/CD32  [CD32]  68.52,93.03 90 top
L5  22uH/CD32  [CD32_INDUCTOR]  40.02,90.25 0 top
L6  2.2uH/2.0A/DCR<0.1R/CD32  [CD32]  58.33,92.74 90 top
L7  1.8uH  [C0402_TI]  19.45,101.72 180 bottom
L8  2.2uH/2.0A/DCR<0.1R/CD32  [CD32]  68.46,84.86 270 top
L11  2.2uH/3A/DCR<0.1R/CD54  [CD52(53)]  57.68,83.7 270 top
L14  2.2uH/2.0A/DCR<0.1R/CD32  [CD32]  77.13,96.23 0 top
LED1  BLUE  [CHIPLED_0805_NOOUTLINE]  81.75,92.85 270 bottom
LED2  BLUE  [CHIPLED_0805_NOOUTLINE]  81.75,88.65 90 bottom
LED3  BLUE  [CHIPLED_0805_NOOUTLINE]  81.75,84.45 90 bottom
LED4  BLUE  [CHIPLED_0805_NOOUTLINE]  81.75,80.25 270 bottom
LED5(/PG)  NC(BLUE)  [CHIPLED_0805_NOOUTLINE]  81.75,117 270 bottom
MICRO_SD  TFC-WPAPR-08  [TFC-WPAPR-08]  76.76,68.73 0 top
P1  TESTPADTESTPAD_40-ROUND  [TESTPAD_40-ROUND]  76.33,94.19 0 bottom
P3.3V  TESTPADTESTPAD_40-ROUND  [TESTPAD_40-ROUND]  16.5,96.5 0 bottom
P5  TESTPADTESTPAD_40-ROUND  [TESTPAD_40-ROUND]  74.64,99.53 0 bottom
PGND  TESTPADTESTPAD_40-ROUND  [TESTPAD_40-ROUND]  16.5,94.5 0 bottom
PSCL  TESTPADTESTPAD_40-ROUND  [TESTPAD_40-ROUND]  16.5,92.5 0 bottom
PSDA  TESTPADTESTPAD_40-ROUND  [TESTPAD_40-ROUND]  16.5,90.5 0 bottom
Q1  24MHz 9pF TSX-3225  [TSX-3225]  28.4,75.3 0 top
Q3  BC817-40(SOT23)  [SOT23]  28.7,69.4 180 top
R1  0R(Board_Mounted)  [R0402_TI_0R]  35.59,70.89 225 top
R2  0R(Board_Mounted)  [R0402_TI_0R]  31,72.1 0 top
R2KEY  1k/1%  [R0402_TI]  5.43,63.46 90 top
R3  2k/1%  [R0402_TI]  54.56,48.4 270 top
R3KEY  2.7k/1%  [R0402_TI]  5.43,69.08 90 top
R4  10k/5%  [R0402_TI]  72.17,89.64 180 top
R5  10k/5%  [R0402_TI]  54.69,88.77 0 top
R6  0R(Board_Mounted)  [R0402_TI_0R]  63.2,78.11 180 top
R7  0R(Board_Mounted)  [R0402_TI_0R]  55.52,99.15 0 top
R8  0R(Board_Mounted)  [R0402_TI_0R]  21.72,99.84 180 bottom
R9  2k/1%  [R0402_TI]  55.21,46.31 270 top
R10  0R(Board_Mounted)  [R0402_TI_0R]  20.78,98.91 180 bottom
R11  10k/5%  [R0402_TI]  52.5,28.3 270 top
R11-C  270k/1%  [R0402_TI]  76.39,106.7 270 top
R12  10k/5%  [R0402_TI]  14.77,59.26 270 top
R12-C  100k/1%  [R0402_TI]  76.38,104.67 270 top
R13  1k/1%  [R0402_TI]  30.47,92.78 270 top
R14  30k/1%  [R0402_TI]  63.52,83.43 270 top
R15  10k/5%  [R0402_TI]  66.49,78.9 180 top
R16  10k/5%  [R0402_TI]  66.58,63.51 90 top
R17  10k/5%  [R0402_TI]  35.7,69.65 135 bottom
R18  12R/1%  [R0603_5MIL_DWS]  46.95,93.1 90 bottom
R18-C  1k/1%  [R0402_TI]  68.39,111.62 90 top
R19  10k/5%  [R0402_TI]  31.51,89.07 90 top
R20  10k/5%  [R0402_TI]  65.8,69.56 180 top
R21  12R/1%  [R0603_5MIL_DWS]  46.68,90.62 180 bottom
R21-C  100k/1%  [R0402_TI]  69.29,111.53 90 top
R22  33R/1%  [R0402_TI]  66.24,73.35 180 top
R23  0R(Board_Mounted)  [R0402_TI_0R]  73,59.2 270 top
R24  200k/1%  [R0402_TI]  30.97,73.04 180 top
R25  100k/1%  [R0402_TI]  33.5,70.16 180 top
R26  1k/1%  [R0402_TI]  5.83,71.33 90 top
R27  0R(Board_Mounted)  [0603_0R]  32.14,10.21 90 top
R28  18R/1%  [R0402_TI]  22.32,101.79 180 bottom
R29  56R/1%  [R0402_TI]  22.32,100.79 180 bottom
R30  1M/1%  [R0402_TI]  38.15,103.16 180 bottom
R31  100R/1%  [R0402_TI]  55.9,14.4 180 top
R32  1k/1%  [R0402_TI]  45.41,93.09 90 bottom
R33  100R/1%  [R0402_TI]  55.9,16.9 180 top
R34  10k/5%  [R0402_TI]  48.5,28.3 270 top
R35  10k/5%  [R0402_TI]  44.5,28.3 270 top
R36  NC  [R0402_TI]  50.5,28.3 270 top
R37  NC  [R0402_TI]  52.5,30.25 90 top
R38  10k/5%  [R0402_TI]  34.03,69.26 180 top
R39  10k/5%  [R0402_TI]  42.5,28.3 270 top
R40  NC  [R0402_TI]  46.5,30.25 90 top
R41  NC  [R0402_TI]  46.5,28.3 270 top
R42  6k/1%  [R0402_TI]  42.86,80.6 0 bottom
R43  27k/1%  [R0603_5MIL_DWS]  5.33,84.27 0 bottom
R44  560R/5%  [R0603_5MIL_DWS]  8.56,118.61 270 top
R45  560R/5%  [R0603_5MIL_DWS]  6.87,118.65 270 top
R46  NC(560R)  [R0603_5MIL_DWS]  10.29,82.24 180 bottom
R47  27k/1%  [R0603_5MIL_DWS]  8.64,79.83 90 bottom
R48  2k/1%  [R0402_TI]  11.51,87.07 90 bottom
R49  2k/1%  [R0402_TI]  10.43,87.07 90 bottom
R50  27k/1%  [R0603_5MIL_DWS]  13.76,87.61 90 top
R51  10k/5%  [R0402_TI]  41.25,30.26 90 top
R52  10k/5%  [R0402_TI]  39.44,30.26 90 top
R53  11.8k/1%  [R0402_TI]  56.66,106.02 0 bottom
R54  10k/5%  [R0402_TI]  38.54,30.26 90 top
R55  10k/5%  [R0402_TI]  40.33,30.26 90 top
R56  NC  [R0402_TI]  77,78.2 180 top
R57  10k/5%  [R0402_TI]  37.63,28.32 270 top
R58  10k/5%  [R0402_TI]  36.72,28.32 270 top
R59  10k/5%  [R0402_TI]  42.5,30.25 90 top
R60  10k/5%  [R0402_TI]  35.8,28.3 270 top
R61  150k/1%  [R0402_TI]  61.64,93.64 0 top
R62  10k/5%  [R0402_TI]  37.63,30.26 90 top
R63  10k/5%  [R0402_TI]  35.8,30.27 90 top
R64  10k/5%  [R0402_TI]  36.72,30.27 90 top
R65  100k/1%  [R0402_TI]  61.63,92.74 180 top
R66  10k/5%  [R0402_TI]  44.5,30.25 90 top
R67  10k/1%  [R0402_TI]  65.07,83.9 180 top
R68  10k/1%  [R0402_TI]  65.06,84.8 0 top
R69  10k/5%  [R0402_TI]  38.53,28.32 270 top
R70  10k/5%  [R0402_TI]  39.43,28.32 270 top
R71  10k/5%  [R0402_TI]  40.33,28.32 270 top
R72  10k/5%  [R0402_TI]  41.25,28.32 270 top
R73  10k/5%  [R0402_TI]  34.72,70.95 135 bottom
R74  150k/1%  [R0402_TI]  65.12,93.69 180 top
R75  33k/1%  [R0402_TI]  65.13,92.8 0 top
R76  20k/5%  [R0402_TI]  74.13,89.64 180 top
R77  56R/1%  [R0402_TI]  17.1,101 90 bottom
R78  8.2k/1%  [R0402_TI]  81.88,102.49 270 top
R79  11.8k/1%  [R0402_TI]  62.02,84.76 180 top
R80  10k/1%  [R0402_TI]  62.02,83.87 180 top
R81  100k/1%  [R0402_TI]  73.66,84.65 0 top
R82  30K/1%  [R0402_TI]  53.8,11.6 0 top
R83  20k/5%  [R0402_TI]  10.75,86.87 180 top
R84  10k/5%  [R0402_TI]  50.5,30.25 90 top
R85  1.1k/1%  [R0402_TI]  80.35,102.49 270 top
R87  10k/5%  [R0402_TI]  54.5,30.25 90 top
R88  10k/5%  [R0402_TI]  27.78,72.22 0 top
R89  10k/5%  [R0402_TI]  60.5,30.25 90 top
R90  NC(10k/5%)  [R0402_TI]  60.5,28.3 270 top
R92  NC(10k/5%)  [R0402_TI]  23.2,54.3 90 top
R93  NC(10k/5%)  [R0402_TI]  14.7,69.1 0 top
R94  NC(10k/5%)  [R0402_TI]  14.7,70.1 0 top
R95  NC(10k/5%)  [R0402_TI]  58.5,30.25 90 top
R96  NC(10k/5%)  [R0402_TI]  14.7,73.1 0 top
R97  NC(10k/5%)  [R0402_TI]  62.5,28.35 270 top
R98  NC(10k/5%)  [R0402_TI]  48.5,30.25 90 top
R99  10k/5%  [R0402_TI]  56.5,30.25 90 top
R100  NC(10k/5%)  [R0402_TI]  14.7,71.1 0 top
R101  10k/5%  [R0402_TI]  54.5,28.3 270 top
R102  10k/5%  [R0402_TI]  58.5,28.3 270 top
R103  10k/5%  [R0402_TI]  56.5,28.3 270 top
R104  NC(10k/5%)  [R0402_TI]  22.2,54.3 90 top
R105  NC(10k/5%)  [R0402_TI]  21.2,54.3 90 top
R106  NC(10k/5%)  [R0402_TI]  14.7,74.1 0 top
R107  10k/5%  [R0402_TI]  11.98,59.26 90 top
R108  0R(Board_Mounted)  [R0402_TI_0R]  71,18.7 180 top
R109  NC(10k/5%)  [R0402_TI]  14.7,68.1 0 top
R110  10k/5%  [R0402_TI]  26.1,71.35 90 top
R113  10k/5%  [R0402_TI]  14.7,75.1 0 top
R118  10k/5%  [R0402_TI]  14.7,72.1 0 top
R120  10k/5%  [R0402_TI]  68.46,120.24 90 bottom
R124  10k/5%  [R0402_TI]  79.34,117.21 0 top
R154  10k/5%  [R0402_TI]  51.5,14.05 0 top
RLED-1  10k/5%  [R0402_TI]  81.64,90.8 0 bottom
RLED-2  10k/5%  [R0402_TI]  80.88,87.14 180 bottom
RLED-3  10k/5%  [R0402_TI]  81.62,82.26 180 bottom
RLED-4  10k/5%  [R0402_TI]  81.67,78.46 180 bottom
RLED-5  NC(10k/5%)  [R0402_TI]  78.43,117.69 0 bottom
SELECT  PAD_BUTTON  [PAD_BUTTON]  54.5,12.8 270 bottom
SELECT3  PAD_BUTTON  [PAD_BUTTON]  9.7,54.7 270 bottom
SELECT4  PAD_BUTTON  [PAD_BUTTON]  37,27 315 bottom
START  PAD_BUTTON  [PAD_BUTTON]  39.6,12.5 225 bottom
TP1  TESTPADTESTPAD_40-ROUND  [TESTPAD_40-ROUND]  63.14,81.66 0 bottom
TP2  TESTPADTESTPAD_40-ROUND  [TESTPAD_40-ROUND]  37,71.22 0 bottom
TP3  TESTPADTESTPAD_40-ROUND  [TESTPAD_40-ROUND]  50.3,85.85 0 bottom
TP4  TESTPADTESTPAD_40-ROUND  [TESTPAD_40-ROUND]  50.3,84 0 bottom
TP5  TESTPADTESTPAD_40-ROUND  [TESTPAD_40-ROUND]  20.9,9.2 0 bottom
TP6  TESTPADTESTPAD_40-ROUND  [TESTPAD_40-ROUND]  23,9.3 0 bottom
TP7  TESTPADTESTPAD_40-ROUND  [TESTPAD_40-ROUND]  16,101 0 bottom
TP8  TESTPADTESTPAD_40-ROUND  [TESTPAD_40-ROUND]  37.66,73.51 0 bottom
TP9  TESTPADTESTPAD_40-ROUND  [TESTPAD_40-ROUND]  39.58,73.87 0 bottom
TP10  TESTPADTESTPAD_40-ROUND  [TESTPAD_40-ROUND]  40.55,76.59 0 bottom
TP11  TESTPADTESTPAD_40-ROUND  [TESTPAD_40-ROUND]  61.96,106.87 0 bottom
TP12  TESTPADTESTPAD_40-ROUND  [TESTPAD_40-ROUND]  76.97,80.68 0 bottom
TP15  TESTPADTESTPAD_40-ROUND  [TESTPAD_40-ROUND]  13.59,15.17 315 bottom
TP16  TESTPADTESTPAD_40-ROUND  [TESTPAD_40-ROUND]  15,13.75 315 bottom
TP-PD10  TESTPADTESTPAD_40-ROUND  [TESTPAD_40-ROUND]  51.5,71.5 0 bottom
TP-PD16  TESTPADTESTPAD_40-ROUND  [TESTPAD_40-ROUND]  51.5,70 0 bottom
TP-PD17  TESTPADTESTPAD_40-ROUND  [TESTPAD_40-ROUND]  51.5,68.5 0 bottom
U1  ALLWINNER-H3(FBGA-347)  [FBGA-347]  45.16,74.97 225 top
U1-A  PAM8302AASCR  [MSOP8_0.65MM]  48.95,16.36 90 top
U2  K4B4G1646D-BYK0(FBGA-96_256Mx16_DDR3-1600_11-11-11)  [FBGA96(HYNIX_SAMSUNG_512MX16_DDR3)]  53.92,56.96 270 top
U3  K4B4G1646D-BYK0(FBGA-96_256Mx16_DDR3-1600_11-11-11)  [FBGA96(HYNIX_SAMSUNG_512MX16_DDR3)]  35.49,56.96 270 top
U4  MCP73781T-2CCI/ML  [QFN20_4MM]  72.46,110.31 180 top
U5  RCLAMP0524P  [SLP2510P8]  11.3,78.05 90 top
U6  RCLAMP0524P  [SLP2510P8]  11.3,81.22 90 top
U7  RCLAMP0524P  [SLP2510P8]  11.3,84.4 90 top
U8  SY6280AAC(SOT23-5)  [SOT23-5]  57.51,103.45 0 bottom
U16  SY7152(SOT23-6)  [SOT23-6]  76.99,99.88 0 top
U57  AXP8036  [QFN4X4]  63.45,88.83 270 top
U$4  JST_PH_VERT_5P  [JST_PH_VERT_5P]  80.6,38 270 top
U$6  SS-12F21(1P2T)  [SS-12F21(1P2T)]  73,116.42 0 top
U$8  JST_PH_VERT_2P  [JST_PH_VERT_2P]  66.15,103.85 270 top
U$9  [PB]  70.18,31.27 0 top
U$11  CSD22205L  [CSD22205L]  73.85,105.8 0 top
U$14  KA2707  [SOT23-6']  33.05,92.72 180 top
U$15  TACT_SWITCH_HORIZONTAL  [TACT_SWITCH_HORIZONTAL]  2.1,105 90 top
U$16  [8BCRAFT]  8.3,27.68 0 top
U$17  MICROUSB_HAYATO  [MICROUSB_HAYATO]  79.4,111 270 top
U$18  PM25LV512  [SOIC8]  44.06,99.25 180 bottom
U$23  AMT630A  [LQFP-ST-64-2]  32.6,96.79 270 bottom
U$24  PJ342_5PIN  [PJ342_6P]  47,-0.04 90 top
U$27  WHEEL_POT  [WHEEL_POT]  25,12 180 top
U$29  JST2_HAYATO  [JST2_HAYATO]  17.02,13.93 135 top
U$33  NC/(TACT_SWITCH_HORIZONTAL)  [TACT_SWITCH_HORIZONTAL]  81.9,50 270 top
U$35  MCP3208  [MCP3208]  73.48,13.91 0 top
U$36  TACT_SWITCH_HORIZONTAL  [TACT_SWITCH_HORIZONTAL]  2.1,55 90 top
U$37  TACT_SWITCH_HORIZONTAL  [TACT_SWITCH_HORIZONTAL]  2.1,61 90 top
U$38  TACT_SWITCH_HORIZONTAL  [TACT_SWITCH_HORIZONTAL]  2.1,67 90 top
U$41  [ROHS]  65.51,20.28 0 top
U$42  [RECYCLE_BIN1/8]  67.43,46.2 0 top
U$43  [ESD_SYMBOL]  24.2,21.9 0 top
UART0-DBG  NA(HN1X5)  [HN1X5]  19,64 270 top
USB1  USB_TWO_LEVELALINKTEK  [USB_TWO_LEVEL_ALINKTEK]  58,114.4 180 top
USB2  USB_TWO_LEVELALINKTEK  [USB_TWO_LEVEL_ALINKTEK]  39.5,114.4 180 top
V_OUT  NA(HN1X5)  [HN1X5]  7.8,100.5 90 top
VCC-RTC  TESTPADTESTPAD_40-ROUND  [TESTPAD_40-ROUND]  55.36,88.45 0 bottom
VR1  LC1463CB5ATR33(SOT23-5)  [SOT-23-5]  58.4,100.99 0 top
XL2AMT  27MHz  [HC49UP]  35.31,101.5 180 top

## Tracks (layer width: path | path; a pad name or v marks a point on that pad's centre or on a via)
+3V3_A  (via drill 0.3)
  Top 0.23: v32.57,100.02 36.01,100.02 v36.71,101.12
  Bottom 0.2: U$23.16 36.79,101.19 37.22,101.19 C134.2
  Bottom 0.23: v32.57,100.02 32.17,99.62 29.19,99.62 29,99.81 28.72,99.81 U$23.64 27.56,99.79 27.45,99.9 24.84,99.9 C94.2 | v36.71,101.12 36.7,101.14 36.79,101.19
  Bottom 0.406: 24.73,99.87 C94.2 24.72,99.8 24.47,99.29 24.29,99.11 22,99.11 21.79,98.9 21.5,98.9 R10.2
+5V  (via drill 0.5)
  Top 0.305: R78.2 82.53,101.61 83.3,100.84 83.3,96.68 D9.1
  Top 0.406: v76.62,91.92 76.62,91.41 C89.1 78.89,91.68 79.42,91.68 81.45,93.71 D9.1
  PWR 1.676: v11.27,103.07 v11.27,102.24 v11.28,102.23 24.23,102.23 28.26,106.26 32.47,106.26 v34.17,107.96 | v35.42,107.96 34.33,107.96 34.21,107.84
  Bottom 0.305: P1.1 76.26,94.12 v76.26,92.63
  Bottom 0.4: 60.16,103.09 59.57,102.5 U8.5
  Bottom 0.61: C91.1 61.21,102.5 U8.5 U8.4
  Bottom 1.676: v11.28,102.23 11.28,103 | v34.17,107.96 v35.42,107.96 37.08,107.96 38.89,106.15 47.54,106.16 48.72,104.69 48.72,100.67 49.37,100.02 57.81,100.02 60.16,102.37 60.16,103.09 | V_OUT.2 V_OUT.1 10,95.42 D3.A 11.11,102.91 v11.27,103.07
  other vias: 75.48,92.63 75.85,91.93 75.07,91.94
  pour Top (isolate 0.3, no thermals): 80.23,95.49 80.23,94.16 79.62,93.52 75.37,92.97 74.46,92.63 74.37,91.6 78.97,90.67 80.33,90.87 80.77,91.05 80.77,91.13 82.81,93.17 82.81,94.29 82.18,94.92
  pour Bottom (isolate 0.3, no thermals): 76.3,93.11 76.83,93.11 77.43,92.53 77.43,91.6 76.8,91.18 74.59,91.35 66.64,99.36 58.87,102.27 58.41,102.73 58.41,104.46 58.92,104.97 67.96,101.61 75.75,93.35
+5V_USB
  Bottom 0.406: TP11.1 60.6,106.87 59.64,107.83
  Bottom 0.61: 52.12,105.53 52.12,105.71 C96.1
  Bottom 0.813: 61.5,109.69 USB1.1.1 USB1.2.1 | 43,110.42 USB2.1.1 USB2.2.1
  Bottom 1.016: L2.1 52.03,105.43 52.12,105.53 | 43,110.42 44.51,108.64 48.92,108.64 51.48,106.34 | 51.48,106.34 52.12,105.71 | 61.5,109.69 59.64,107.83 59.5,107.69 52.83,107.69 51.48,106.34
+7V  (via drill 0.2, 0.3, 0.5)
  Top 0.229: v43.33,78.16 43.31,78.13 43.3,77.79 43.3,77.71 U1.K6
  Top 0.25: 54.33,88.76 R5.1 | v72.75,90.46 72.75,89.7 R4.1 | v68.1,78.8 67.09,78.8 R15.1
  Top 0.254: v33.77,68.52 33.77,69 R38.2
  Top 0.406: R5.1 54.34,89.51 v54.34,89.62 54.31,89.5 52.7,89.5 | R7.1 53.45,99.15 52.2,97.9 52.2,90 52.7,89.5 | 52.7,89.5 53.45,88.75 53.45,86.05 53.35,85.95 53.35,84.15 53.72,83.78 v53.72,82.87
  PWR 0.2: 43.6,77.6 43.6,76.47 42.88,75.75 42.88,73.37 42.64,73.13 40.75,73.12 40.25,72.57 38.35,72.57 34.38,68.7 33.95,68.7 v33.77,68.52
  PWR 0.406: v53.72,82.87 53.4,81.9 47.81,81.9 46.5,80.59 46,80.19 45.85,80 44.6,78.7 44.08,78.7 43.74,78.46 v43.33,78.16 43.43,78.22 43.6,77.6
  Bottom 0.127: R73.1 34.36,69.11 v33.77,68.52 34.54,69.29 R17.1
  Bottom 0.25: 54.28,89.57 v54.34,89.62 | 55.7,89.46 61.24,83.92 66.91,83.97 | 66.91,83.97 v72.75,90.46 | 66.91,83.97 66.91,80 v68.1,78.8
  Bottom 0.254: 33.83,68.58 v33.77,68.52 | 54.28,89.57 55.28,89.33 VCC-RTC.1
  Bottom 0.305: C72.2 42.63,77.61 v43.33,78.16
  Bottom 0.406: 55.7,89.46 54.39,89.46 v54.34,89.62
AGND
  Bottom 0.2: 29.25,100.2 29.95,100.2 30.21,100.31 30.21,101.05 U$23.2 | U$23.3 30.4,100.35 30.55,100.2 31.05,100.2 31.19,100.29 31.19,101.13 U$23.5
  Bottom 0.23: 29.25,100.2 29.15,100.3 | C93.1 30.6,103.99 30.6,104
  Bottom 0.25: U$23.3 U$23.2 | C141.1 34.4,103.37 U$23.13 34.4,100.43 34.67,100.16 35.94,100.16 36.3,100.52 38.45,100.52 38.45,100.84 C134.1 | U$23.5 31.2,103.4 30.6,104 30.15,104.45 | C94.1 23.68,100.23 23.95,100.5 28.95,100.5 29.15,100.3
  Bottom 0.254: C134.1 40.34,101.15 C142.1
  Bottom 0.3: R8.2 23.66,99.84 C94.1
  Bottom 0.305: R8.2 21.81,100.26 R29.1
  Bottom 0.406: 30.15,104.45 30.15,105.58 30.86,106.29 34.57,106.29 35.19,105.67 C141.1
AGNDA
  Top 0.406: U$27.GND 29.9,11.1 R27.2 35.4,11.1 40.9,5.6 41.1,5.4 43.8,2.7 U$24.2 U$24.1 52.11,2.11 59.6,9.6 C145.1
AGNDJ  (via drill 0.5)
  Top 0.25: U$35.P$14 71.51,16.68 R108.1 v71.5,19.3
  Bottom 0.25: JOYSTICK_CON.3 72.27,17.33 72.1,17.5 72.1,18.7 v71.5,19.3
AIN+
  Top 0.406: U$24.6 43.8,11.5 44.3,11.5 44.3,10.96 | 49.9,10.96 U$24.5 52.65,10.96 R82.1
  Top 0.61: 44.3,10.96 49.9,10.96
AP-NMI#
  Top 0.102: R38.1 34.53,69.2 34.84,69.24 U1.AA6
AP-RESET#  (via drill 0.2)
  Top 0.102: U1.V6 39.19,74.05 38.85,73.72 38.37,73.72 38.11,73.46 37.69,73.46 36.84,72.61 v36.11,72.61 35.85,72.61 34.61,71.36 C80.2
  Top 0.15: 34.16,71.28 34.14,71.28 33.6,70.74 31.66,70.74 31.38,71.02 30.7,71.02 30.14,70.46 30.14,69.74 Q3.3
  Top 0.2: C80.2 34.16,71.28
  Bottom 0.127: v36.11,72.61 36.09,72.61 35.28,71.8 35.28,71.51 R73.2
AUDIOL  (1 unrouted)
  Bottom 0.2: TP6.1 U$27.3B 27.7,16.7 28.5,16.7 29.8,18 C11.1 | 29.9,18.11 29.89,18.1
AUDIOR
  Bottom 0.2: TP5.1 20.9,11.9 U$27.3A 27.4,18.4 C14.1
B0
  Bottom 0.127: U$23.24 37.03,96.96 37.75,96.96 40.24,94.45 FPC54P.12
B1
  Bottom 0.127: U$23.25 37.02,96.58 37.72,96.58 39.89,94.41 39.89,92.08 39.83,92.01 39.83,88.29 FPC54P.13
B2
  Bottom 0.127: FPC54P.14 39.24,88.71 39.21,91.98 39.54,92.35 39.55,94.36 37.71,96.2 U$23.26
B3
  Bottom 0.127: FPC54P.15 38.73,92.07 39.22,92.61 39.22,94.29 37.7,95.81 37.02,95.81 U$23.27
B4
  Bottom 0.127: FPC54P.16 38.22,92.15 38.88,92.83 38.88,94.24 37.68,95.43 37.04,95.43 U$23.28
B5
  Bottom 0.127: FPC54P.17 37.79,92.26 38.55,93.03 38.55,94.15 37.77,94.93 37.07,94.93 U$23.29
B6
  Bottom 0.127: FPC54P.18 37.24,92.27 38.24,93.26 38.24,94.02 37.73,94.55 37.05,94.55 U$23.30
B7
  Bottom 0.127: FPC54P.19 36.74,92.28 37.94,93.5 37.94,93.9 37.71,94.15 37.03,94.16 U$23.31
B/L_EN  (via drill 0.3)
  Top 0.2: 30.61,93.81 R13.1
  Top 0.23: 30.61,93.81 30.09,94.33 v30.09,96.14
  Bottom 0.23: v30.09,96.14 30.03,96.19 U$23.55
CH3
  Top 0.254: U$35.P$4 72.84,10.46 75.4,7.9 78.9,7.9 80.3,6.5
  Top 0.406: 80.3,6.5 80.6,6.2 80.6,5.4 CH3.1
CPUX-VSET  (via drill 0.2, 0.3)
  Top 0.2: U1.T4 v39.21,75.89 v39.2,75.89 | v70.43,78.09 69.88,77.5 63.24,77.5 62.74,77.86 R6.2
  PWR 0.2: v39.2,75.89 39.2,75.96 39.22,75.97 38.73,76.45 38.73,76.9 38.66,76.97 38.66,77.04 38.41,77.29 38.41,80.03 47.98,89.67 53.03,89.67 54.1,88.6 56.5,88.6 60.8,84.3 70.43,84.3 71.56,85.43 72.85,85.43 73.05,85.23 73.05,80.71 v70.43,78.09
DCLK  (via drill 0.3)
  Top 0.127: v28.32,90.56 28.29,89.34 28.29,87.94 v27.52,87.19
  Bottom 0.127: U$23.51 27.29,94.59 26.91,94.21 26.91,93.3 27.9,92.51 28.45,92.1 28.45,91.75 28.45,90.68 v28.32,90.56 | v27.52,87.19 27.4,87.18 27.27,87.31 27.27,88.17 FPC54P.38
DE  (via drill 0.3)
  Top 0.127: v27.9,91 27.89,88.39 v26.7,87.2
  Bottom 0.127: U$23.52 27.11,94.99 26.61,94.49 26.61,93.17 27.52,92.26 27.52,91.38 v27.9,91 | v26.7,87.2 20.26,87.2 20.16,87.31 20.16,88.12 FPC54P.52
ENABLE  (via drill 0.3)
  Top 0.25: 72.99,106.25 73.06,106.33 v72.99,106.18 73.12,106.3 73.5,106.2 U$11.G 73.5,106.05
  Bottom 0.2: v72.99,106.18 78.03,106.18 78.94,107.09 78.94,112.7 77.34,114.3 72.07,114.3 71.62,115.4 72.69,116.42 U$6.IN
EPHY_LINK_LED
  Top 0.102: 45.16,83.7 44.64,84.22
  Top 0.127: R44.2 8.56,115.89 9.89,114.55 9.89,109.58 22.21,97.17 22.24,86.72 24.73,84.22 44.64,84.22 | U1.A2 45.16,83.7
EPHY_RXN
  Top 0.127: 15.58,107.59 15.99,107.89 17.51,109.41 17.51,109.98 18.38,110.84 25.53,110.84 26.48,109.89 26.48,107.19 24.82,105.53 24.82,87.22 26.02,86.02 29.82,86.02 30.25,86.45 45.09,86.45 46.65,84.89 46.65,83.72 46.74,83.63 46.74,83.03 46.54,82.84 U1.A4
  Top 1.016: 15.58,107.59 15.35,107.36 15.06,107.15 CON1.8
EPHY_RXP
  Top 0.102: 46.54,82.33 47.03,82.81
  Top 0.127: 16.24,109.98 17.06,110.05 18.18,111.17 25.79,111.17 26.9,110.06 26.89,107.15 25.11,105.37 25.11,87.33 26.13,86.31 29.61,86.31 30.05,86.75 45.21,86.75 46.94,85.02 46.94,83.87 47.03,83.78 47.03,82.81 | U1.B4 46.54,82.33
  Top 1.016: 16.24,109.98 16.34,109.89 CON1.7
EPHY_SPD_LED
  Top 0.102: 45.5,82.44 43.98,83.97
  Top 0.127: U1.F7 45.62,80.39 44.99,81.02 44.99,81.5 45.5,82.02 45.5,82.44 | 43.98,83.97 24.57,83.96 21.94,86.59 21.94,97.05 9.38,109.6 9.38,114.41 7.35,116.45 7.35,117.27 R45.2
EPHY_TXN
  Top 0.127: 23.23,106.81 23.23,87.09 25.2,85.12 45.58,85.12 46.08,84.62 U1.A3
  Top 1.016: 23.23,106.81 22.73,107.31 CON1.2
EPHY_TXP
  Top 0.102: 46.08,82.78 46.46,83.16
  Top 0.127: 23.99,109.09 23.99,107.44 24.12,107.31 24.12,106.43 23.48,105.79 23.51,87.18 25.29,85.4 45.7,85.4 46.37,84.74 46.37,83.54 46.46,83.45 46.46,83.16 | U1.B3 46.08,82.78
  Top 1.016: 23.99,109.09 23.93,109.15 23.95,109.17 CON1.1
G0
  Bottom 0.127: U$23.32 | U$23.32 36.27,93.06 36.27,88.23 FPC54P.20
G1
  Bottom 0.127: U$23.33 35.6,91.89 35.74,91.76 FPC54P.21
G2
  Bottom 0.127: U$23.34 35.2,88.24 FPC54P.22
G3
  Bottom 0.127: U$23.35 34.8,88.26 FPC54P.23
G4
  Bottom 0.127: U$23.36 34.4,89.01 34.31,88.92 34.31,88.33 FPC54P.24
G5
  Bottom 0.127: U$23.37 34,91.75 34.07,91.67 34.07,89.2 33.76,88.89 33.76,88.22 FPC54P.25
G6
  Bottom 0.127: U$23.38 33.65,91.72 33.77,91.52 33.79,89.42 33.3,88.92 33.3,88.26 FPC54P.26
G7
  Bottom 0.127: U$23.39 33.2,91.72 33.3,91.59 33.4,91.52 33.49,91.42 33.49,89.54 32.98,89.08 32.73,88.83 FPC54P.27
GND  (via drill 0.2, 0.3, 0.5)
  Top 0.127: v12.83,78.05 U5.3 | U5.8 v10.16,78.05 | v12.83,81.22 U6.3 | U6.8 v10.16,81.22 | U1.A21 v55.09,74.97 | C154.1 70.31,89.94 70.26,89.89 | U1.G8 45.62,78.17 45.6,78.15 45.58,78.15 U1.H8 | R2.1 30.5,71.52 v30.43,71.45
  Top 0.15: U1.M5 42.49,77.27 42.88,76.89 | 45.51,88.9 48.59,85.82 48.59,83.26 | v50.92,87.41 51.05,87.28 51.05,82.64 49.7,81.29 49.04,81.29 48.9,81.15 48.8,81.15 | v49.43,86.79 49.8,86.42 49.8,83 49.08,82.28 49.07,82.28 | 30.26,85.79 30.16,85.79 30.09,85.72 25.63,85.72 25.45,85.9 v25,86.35 | C80.1 30.52,71.36 v30.43,71.45
  Top 0.152: U1.AA1 35.21,74.97 v35.05,74.74 | R1.2 35.23,70.41 v34.92,70.02
  Top 0.2: v58.73,109.84 56.14,109.84 53.03,106.73 50.78,106.73 v49.96,105.9 48.49,104.44 v48.49,95.99 48.49,95.88 48.5,89.83 v50.92,87.41 v50.92,87.4 | v46.85,104.55 46.96,104.49 v46.95,99.19 46.95,89.27 v49.43,86.79 | 15.77,83.23 15.44,83.23 14.54,82.34 12.78,82.34 12.53,82.59 11.5,82.59 11.49,82.58 | 33.05,94.28 33.05,94.99 v33.34,95.28 | 28.14,80.05 40.09,80.06 | 40.12,80.06 40.09,80.06 | 40.09,80.06 36.85,80.06 v36.71,80.07 | U57.6 62.22,90.18 62.8,89.6 62.8,89.48 63.04,89.24 | 63.04,89.24 U57.P$5 | U57.4 63.22,89.42 63.04,89.24 | C109.2 53.78,98.03 v54.05,98.3 | U3.E2 33.44,59.4 v33.52,59.35
  Top 0.203: 47.36,83.95 47.36,83.1 | v47.33,85.19 47.34,84.23 | v47.01,73.59 U1.K15 47.47,73.58 | 47.47,73.58 v47.91,73.58 47.93,73.59 U1.J16 | 47.93,73.14 v48.37,73.14 48.39,73.17 v48.39,74.04 48.38,74.04 U1.H15 | 47.93,73.14 U1.K16 | 47.93,73.14 47.93,73.56 | 47.47,73.58 47.47,73.15 v47.46,73.13 | v46.53,73.14 46.53,72.69 U1.M15 | U1.M14 v46.08,72.68 U1.N15 | v15.04,83.91 15.72,83.23 15.77,83.23 42.95,83.23 | 17.64,80.01 28.14,80.05 27.75,79.61 C82.1 27.66,78.36 27.44,78.36 27.13,78.1 27.13,76.31 | 39.67,79.19 39.59,79.11 v36.66,79.11 35.72,79.11 | 35.72,79.11 29.44,79.11 29.05,78.72 | 29.05,78.72 28.99,78.66 29.29,78.36 29.4,78.36 30.64,77.12 30.64,75.29 29.8,74.45 29.44,74.45 | C2.1 35.77,79.06 35.72,79.11 | C81.1 29.05,78.52 29.05,78.72 | 50.81,80.37 49.64,80.37
  Top 0.23: C99.1 32.77,89.76 v32.23,89.52 | U$14.2 33.05,94.22 33.05,94.28
  Top 0.25: R18-C.2 68.81,112.72 R21-C.2 69.99,112.72 71.63,111.13 | U57.6 62.22,91.43 v61.95,91.49 61.3,91.76 v61.28,92.01 61.16,92.7 R65.2 | U57.1 64.67,91.53 v64.92,91.78 65.47,91.78 v65.58,92.1 65.66,92.78 R75.2 | U57.13 62.22,86.1 v62.08,85.95 61.75,85.95 v61.47,85.48 61.4,84.87 R79.2 | U57.18 64.67,86.11 v64.91,85.88 65.39,85.88 v65.57,85.5 65.65,84.87 R68.2 | U57.16 63.67,86.09 63.5,85.92 | 63.5,85.92 v63.47,85.89 v63.47,85.11 | 63.5,85.92 63.22,86.19 U57.15 | C86.2 C117.2 65.29,80.96 64.45,80.12 FET2.2 | v40.68,109.11 40.68,108.43 v45.44,103.67 45.44,94.59 v45.48,94.55 45.48,88.93 45.51,88.9 | v45.14,73.58 v44.22,73.58 | v45.14,73.58 U1.N13 | v45.6,73.14 U1.N13 | v45.17,72.68 U1.N13 | v45.14,73.58 U1.M12 | U1.N12 v44.69,73.13 U1.P13 | v44.23,72.67 U1.R12 v43.77,73.13 | v43.32,73.59 43.32,72.67 U1.T11 | v43.31,74.51 U1.P10 | v44.24,75.43 v44.23,75.43 v44.23,74.54 43.78,74.54 U1.N10 | v43.77,74.97 U1.N9 | U1.M11 v44.7,74.06 v44.7,74.05 U1.N11 | v44.22,73.58 44.22,73.13 U1.P12 | v44.22,73.58 44.22,73.59 U1.P11 | v45.17,71.76 45.17,72.21 U1.P14 | v44.69,72.21 U1.R13 | v45.62,72.21 U1.N14 | U1.K14 47.01,74.05 v47.01,74.5 47.01,74.97 U1.J13 | U1.H8 U1.J9 | R108.2 v69.4,18.7 | C68.2 53.67,81.75 v52.7,82.72
  Top 0.254: U7.3 v12.83,84.4 12.88,84.4 | HDMI.11 7.37,81.72 v7.37,81.61 | HDMI.8 7.37,80.22 v7.37,80.21 | HDMI.5 7.37,78.72 v7.37,78.69 | HDMI.2 7.37,77.22 v7.37,77.16 | U7.8 v10.26,84.4 | HDMI.17 7.44,84.72 v7.37,84.65 | U$14.2 33.05,93.61 | U1.N15 v45.62,72.21 U1.P14 U1.R13 U1.P12 | U1.T11 U1.R12 | U1.R12 U1.P13 | U1.P13 U1.N14 | U1.N14 U1.M15 | U1.P12 U1.R11 U1.P10 | U1.P12 U1.N13 U1.M14 U1.L15 | U1.L15 U1.K16 | U1.H15 | U1.N14 U1.M13 U1.N12 | U1.N14 U1.P15 U1.R14 U1.P13 | U1.P10 U1.R9 v42.4,73.62 v42.41,73.62 42.83,73.62 U1.R10 U1.P11 | U1.P10 U1.N11 | U1.N11 U1.M12 45.17,74.05 v45.17,71.76 | v43.31,74.51 U1.M11 U1.N12 | U1.N12 U1.P13 | U1.N9 U1.M10 U1.N11 | U1.N11 U1.P12 | U1.P11 U1.N10 U1.M9 v43.32,75.43 U1.M8 | U1.P11 U1.R12 | U1.N9 v43.32,75.43 v44.24,75.43 U1.L9 | U1.N9 U1.P10 | U1.K8 43.78,76.81 U1.K7 U1.L8 | U1.K8 U1.J9 | U1.N7 U1.M8 | U1.L9 U1.K8 | U1.M9 U1.L8 | U1.L8 U1.M7 | U1.L8 U1.K9 44.72,76.35 44.72,76.8 | U1.M8 | U1.M7 42.41,75.91 | U1.M8 43.32,76.35 U1.L8 | U1.M7 42.85,75.89 42.86,75.89 42.87,75.89 U1.L9 | U1.K8 44.71,76.81 | v47.01,73.59 v47.02,73.6 | U1.H12 U1.J13 U1.K14 | U1.K14 U1.L15 | U1.K13 v47.01,74.5 | U1.K15 47.46,74.05 U1.K14 | U3.T9 38.92,51.19 39.93,51.19 v40.01,51.27 | U2.T1 49.64,49.89 49.28,49.89 v49.11,49.87 49.24,49.9 49.24,49.4 49.77,48.87 DC4.1 | v30.28,58.98 29.81,58.98 DC22.1 | U1.P11 U1.N12 | Q3.2 27.27,68.45 | Q3.2 27.6,66.44 D6.A | Q3.2 27.35,68.45 26.1,69.7 R110.1
  Top 0.3: 79.4,107.16 U$17.P$2 | U4.P$10 70.82,112.27 70.66,112.11 70.49,111.94 U4.P$11 70.54,111.41 70.53,111.4 | 46.24,86.3 45.39,87.15 | 45.39,87.15 44.08,88.46 44.08,102.89 | 25.68,87.42 26.41,86.69 29.38,86.68 29.85,87.15 45.39,87.15 | 25.68,87.42 25.65,87.45 | 22.75,86.95 22.7,87 v22.7,96.71 | v40.68,109.11 40.68,109.65 | 42.85,109.97 42.85,108.73 v43.02,108.56 v46.85,104.55 46.85,105.5 49.74,108.39 52.25,108.39 | v58.73,109.84 59.19,110.3 59.39,110.33 | 50.25,90.5 50.25,90.35 v52.65,87.95 52.65,82.75 v52.7,82.72 52.7,82.26 50.81,80.37 | 50.25,90.5 v50.25,90.6 | 50.25,90.5 50.1,90.65 v50.11,96.04 50.1,103.45 v50.3,103.65 50.3,103.82 51.6,105.12 53.72,105.12 v55.25,106.65 56.68,108.08 59.98,108.08 61.27,109.37 61.27,110.11 | 45.18,85.78 45.06,85.9 30.37,85.9 30.26,85.79 | 25.45,85.9 24.15,87.2 v24.15,91.9 24.14,105.01 | 25.68,87.42 25.68,104.99 25.73,105.04